# EasyEDA Pro project 完模主板.eprj

# Schematic Schematic1
Board Name: Board1; Create Date: 2025-03-10; Page Name: P1; Project Name: 完模1; Schematic Name: Schematic1; Update Date: 2025-05-26; Company: 嘉立创EDA; Page Size: A4; Version: V1.0
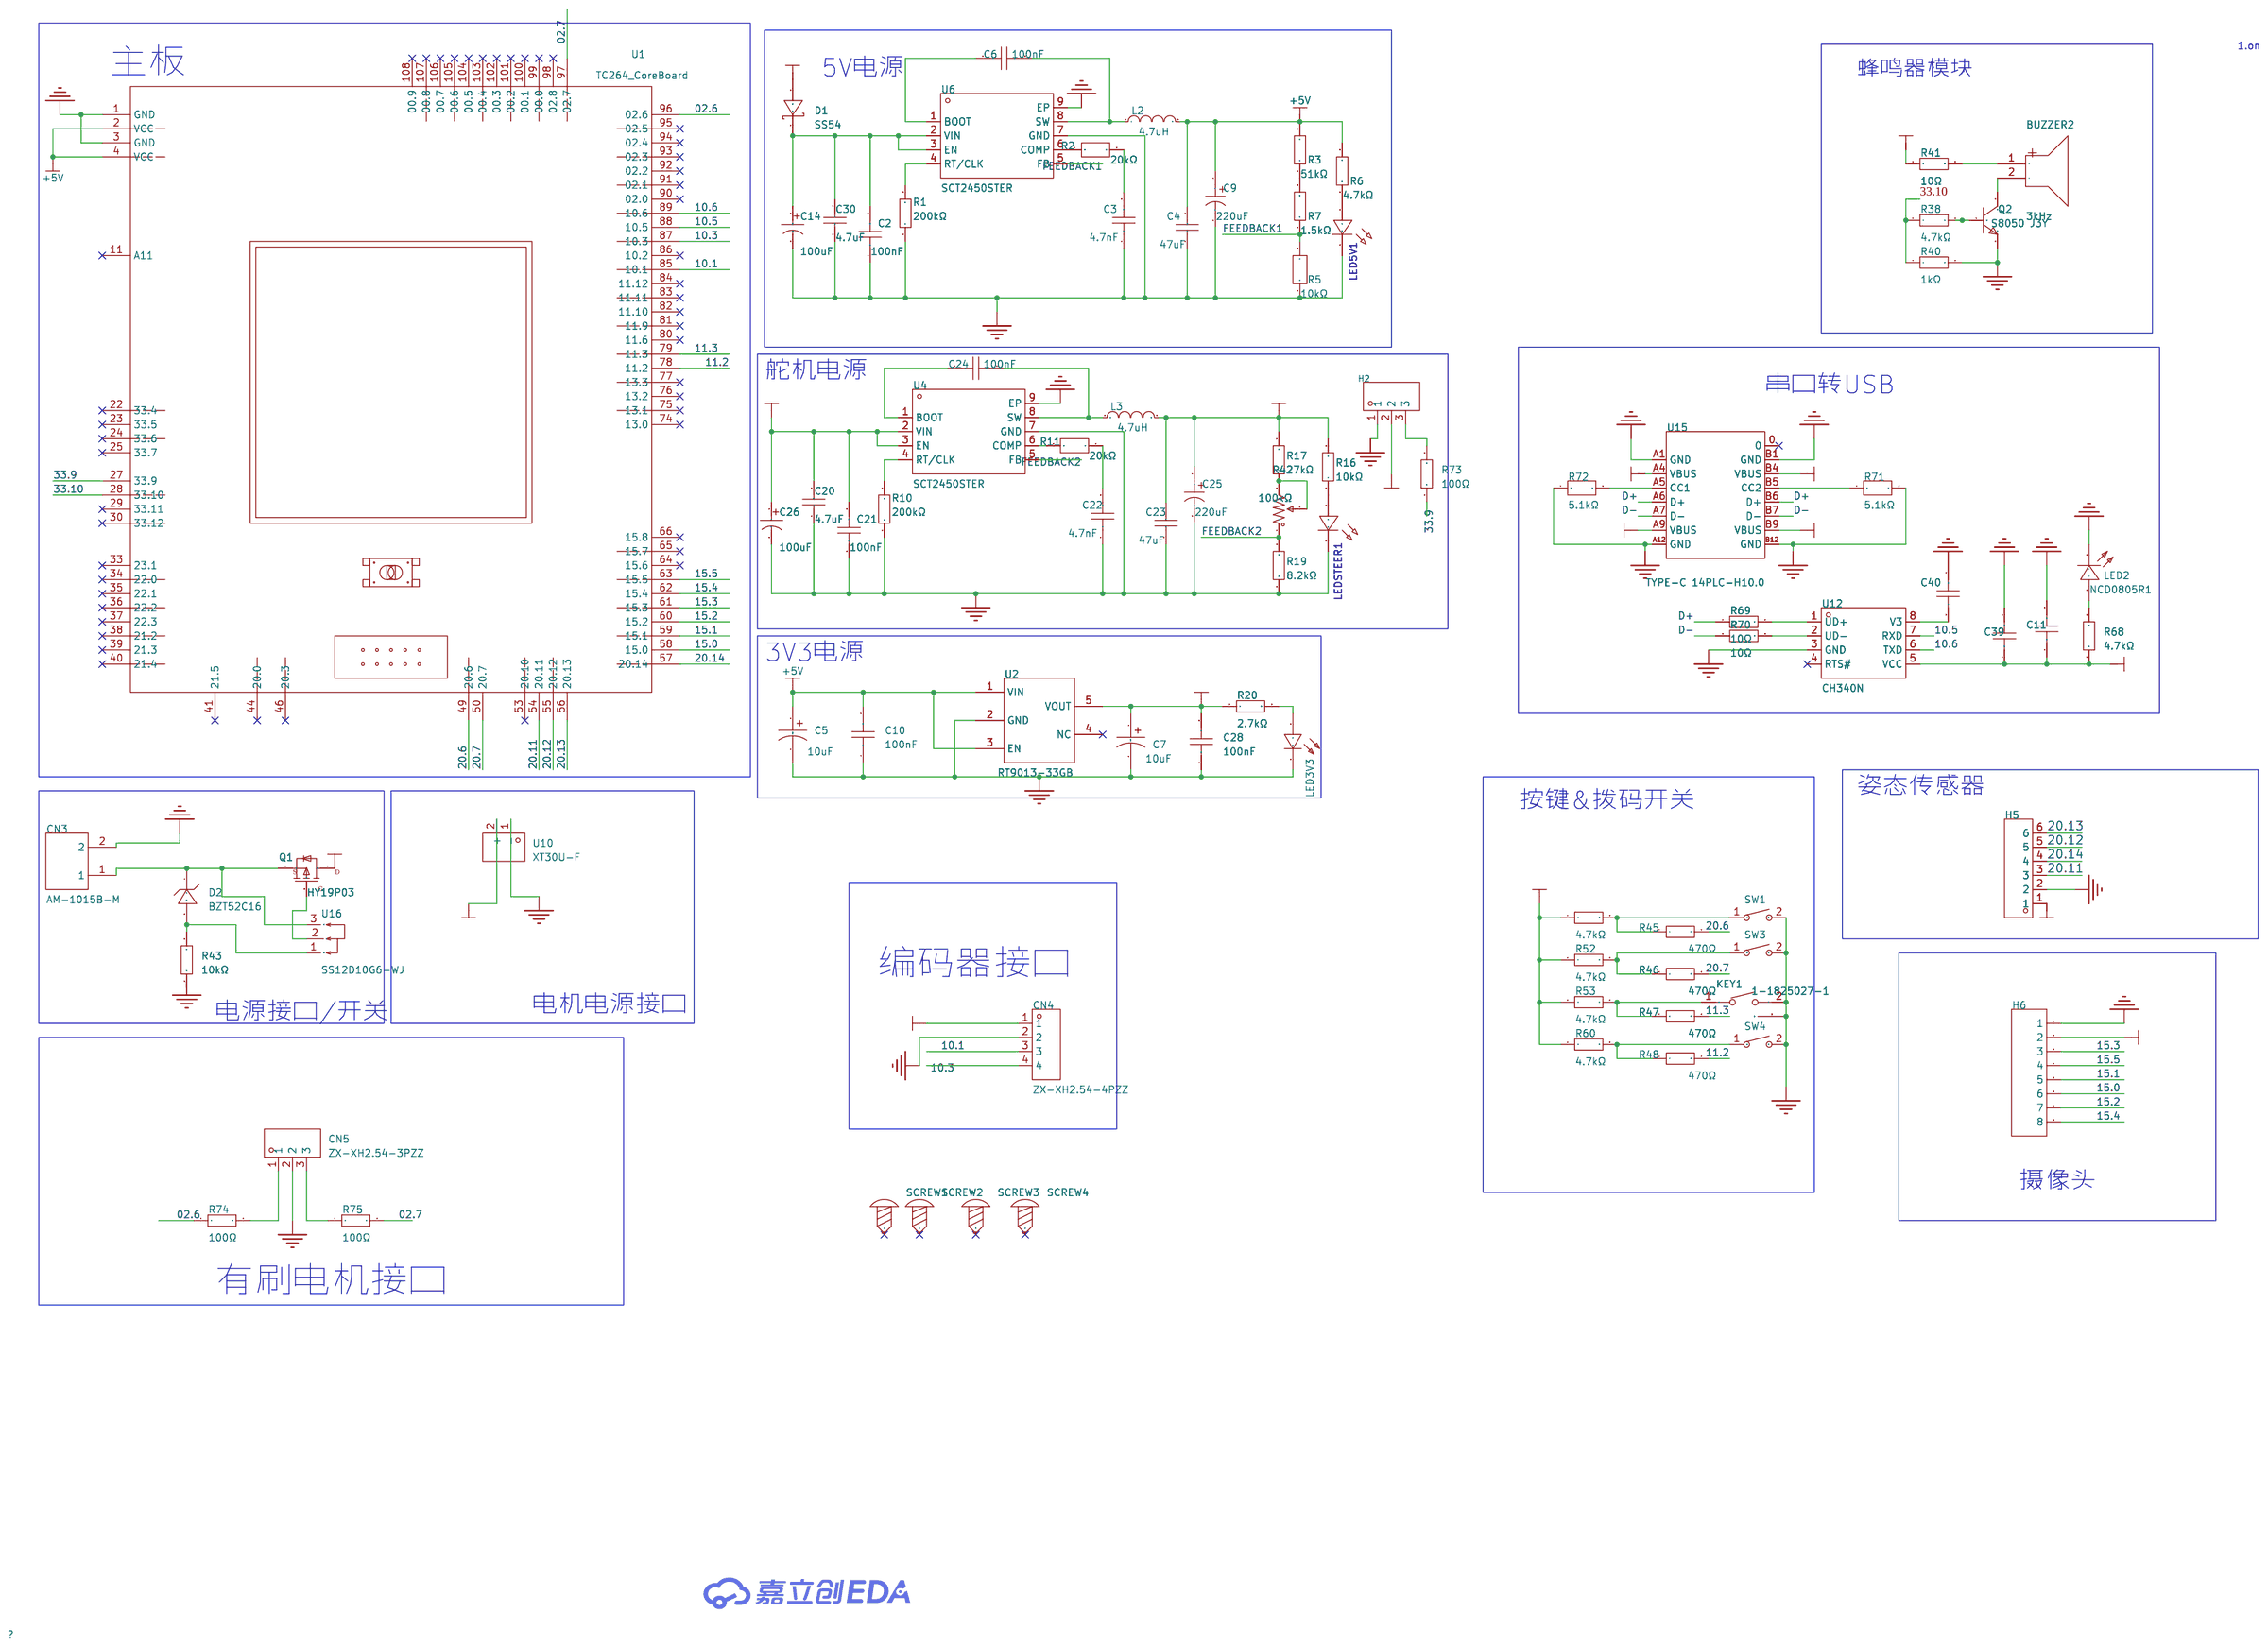
[diagram p0: schematic sheet]

## Parts
BUZZER2  3kHz  [BUZ-TH_BD9.0-P5.00-D0.6-FD]
C2  100nF  [C0603]
C3  4.7nF  [C0603]
C4  47uF  [C0603]
C5  10uF  [CAP-SMD_BD4.0-L4.3-W4.3-LS5.3-FD]
C6  100nF  [C0603]
C7  10uF  [CAP-SMD_BD4.0-L4.3-W4.3-LS5.3-FD]
C9  220uF  [CAP-TH_BD6.3-P2.50-D0.6-FD-1]
C10  100nF  [C0603]
C11  100nF  [C0603]
C14  100uF  [CAP-TH_BD6.3-P2.50-D1.0-FD]
C20  4.7uF  [C0603]
C21  100nF  [C0603]
C22  4.7nF  [C0603]
C23  47uF  [C0603]
C24  100nF  [C0603]
C25  220uF  [CAP-TH_BD6.3-P2.50-D0.6-FD-1]
C26  100uF  [CAP-TH_BD6.3-P2.50-D1.0-FD]
C28  100nF  [C0603]
C30  4.7uF  [C0603]
C39  100nF  [C0603]
C40  100nF  [C0603]
CN3  AM-1015B-M  [CONN-TH_AM-1015B-M]
CN4  ZX-XH2.54-4PZZ  [CONN-TH_4P-P2.50_4PIN]
CN5  ZX-XH2.54-3PZZ  [CONN-TH_3P-P2.54_2501S-3P]
D1  SS54  [SMA_L4.4-W2.8-LS5.4-R-RD]
D2  BZT52C16  [SOD-123_L2.7-W1.6-LS3.7-RD]
H2  PZ254V-11-03P  [HDR-TH_3P-P2.54-V-M]
H5  PZ254V-11-06P  [HDR-TH_6P-P2.54-V-M]
H6  -  [HDR-TH_8P-P2.54-V-M]
KEY1  1-1825027-1  [KEY-TH_1-1825027-1]
L2  4.7uH  [IND-SMD_L5.4-W5.2_FXL0530]
L3  4.7uH  [IND-SMD_L5.4-W5.2_FXL0530]
LED2  NCD0805R1  [LED0805-RD]
LED3V3  SML-H12P8TT86  [LED0805-R-RD_GREEN]
LED5V1  -  [LED_0805]
LEDSTEER1  -  [LED_0805]
Q1  HY19P03  [TO-252AA-TO-252AA_N]
Q2  S8050 J3Y  [SOT-23-3_L3.0-W1.7-P0.95-LS2.9-BR]
R1  200kΩ  [R0603]
R2  20kΩ  [R0603]
R3  51kΩ  [R0603]
R5  10kΩ  [R0603]
R6  4.7kΩ  [R0603]
R7  1.5kΩ  [R0603]
R10  200kΩ  [R0603]
R11  20kΩ  [R0603]
R16  10kΩ  [R0603]
R17  27kΩ  [R0603]
R19  8.2kΩ  [R0603]
R20  2.7kΩ  [R0603]
R38  4.7kΩ  [R0603]
R40  1kΩ  [R0603]
R41  10Ω  [R0603]
R42  100kΩ  [RES-ADJ-TH_3P-L9.7-W5.0-P2.54_T93YA203KT20]
R43  10kΩ  [R0805]
R45  470Ω  [R0603]
R46  470Ω  [R0603]
R47  470Ω  [R0603]
R48  470Ω  [R0603]
R51  4.7kΩ  [R0603]
R52  4.7kΩ  [R0603]
R53  4.7kΩ  [R0603]
R60  4.7kΩ  [R0603]
R68  4.7kΩ  [R0603]
R69  10Ω  [R0603]
R70  10Ω  [R0603]
R71  5.1kΩ  [R0603]
R72  5.1kΩ  [R0603]
R73  100Ω  [R0603]
R74  100Ω  [R0603]
R75  100Ω  [R0603]
SCREW1  -  [M3螺丝]
SCREW2  -  [M3螺丝]
SCREW3  -  [M3螺丝]
SCREW4  -  [M3螺丝]
SW1  TS665WS 200gf(016)  [SW-SMD_L6.0-W6.0-P6.00-LS6.6]
SW3  TS665WS 200gf(016)  [SW-SMD_L6.0-W6.0-P6.00-LS6.6]
SW4  TS665WS 200gf(016)  [SW-SMD_L6.0-W6.0-P6.00-LS6.6]
U1  TC264_CoreBoard  [TC264_main]
U2  RT9013-33GB  [SOT-23-5_L3.0-W1.7-P0.95-LS2.8-BL]
U4  SCT2450STER  [ESOP-8_L4.9-W3.9-P1.27-LS6.0-BL-EP]
U6  SCT2450STER  [ESOP-8_L4.9-W3.9-P1.27-LS6.0-BL-EP]
U10  XT30U-F  [CONN-TH_XT30U-F]
U12  CH340N  [SOP-8_L4.9-W3.9-P1.27-LS6.0-BL]
U15  TYPE-C 14PLC-H10.0  [USB-C-TH_SHOUHAN_TYPE-C-14PLC-H10.0]
U16  SS12D10G6-WJ  [SW-TH_3P-P4.80_HX-SS12D10G6-WJ]

## Library data of the parts
BUZZER2 = HNB09A03: 驱动方式:有源(内含驱动线路);构造类型:电磁式;频率:3kHz;声压(SPL):85dB;; LCSC Part Name: 电磁式有源一体蜂鸣器HNB09A03; Supplier Part: C96102; Manufacturer: 华能; Supplier Footprint: 插件,D=9mm; JLCPCB Part Class: 扩展库; Datasheet: https://atta.szlcsc.com/upload/public/pdf/source/20241128/61C4C8C3938BB25F7C38FBE94CCE8DCF.pdf; Supplier: LCSC; Driver Circuitry: 有源(内含驱动线路); Technology: 电磁式; Voltage - Supply: 1.5V~4.5V; Current Consumption: 30mA; Sound Pressure Level(SPL): 85dB; Diameter(φD): 9mm; Height: 5.5mm; Operating Temperature: -20℃~+70℃
C2 C6 C10 C21 C24 C28 = CGA0603X7R104K500JT: 容值:100nF;精度:±10%;额定电压:50V;材质(温度系数):X7R;; LCSC Part Name: 100nF ±10% 50V; Supplier Part: C6119867; Manufacturer: HRE(芯声); Supplier Footprint: 0603; JLCPCB Part Class: 扩展库; Supplier: LCSC; Tolerance: ±10%; Voltage Rated: 50V; Temperature Coefficient: X7R
C3 C22 = CGA0603X7R472K500JT: 容值:4.7nF;精度:±10%;额定电压:50V;材质(温度系数):X7R;; LCSC Part Name: 4.7nF ±10% 50V; Supplier Part: C7503499; Manufacturer: HRE(芯声); Supplier Footprint: 0603; JLCPCB Part Class: 扩展库; Supplier: LCSC; Tolerance: ±10%; Voltage Rated: 50V; Temperature Coefficient: X7R
C4 C23 = GRM188R60J476ME15D: 容值:47uF;精度:±20%;额定电压:6.3V;材质(温度系数):X5R;; LCSC Part Name: 47uF ±20% 6.3V; Supplier Part: C140782; Manufacturer: muRata(村田); Supplier Footprint: 0603; JLCPCB Part Class: 扩展库; Datasheet: https://atta.szlcsc.com/upload/public/pdf/source/20171113/C140782_15105612981581115778.pdf; Supplier: LCSC; Tolerance: ±20%; Voltage Rated: 6.3V; Temperature Coefficient: X5R
C5 C7 = UWX1C100MCL1GB: 容值:10uF;精度:±20%;额定电压:16V;纹波电流:23mA@120Hz;等效串联电阻:-;; LCSC Part Name: 10uF ±20% 16V; Supplier Part: C445047; Manufacturer: Nichicon(尼吉康); Supplier Footprint: SMD,D4xL5.4mm; JLCPCB Part Class: Extended Part; Datasheet: https://atta.szlcsc.com/upload/public/pdf/source/20191118/C445054_21BB3AEDE2A60A435477784FBA04E610.pdf; Supplier: LCSC; Tolerance: ±20%; Rated Voltage: 16V; Ripple Current: 23mA@120Hz; φD: 4mm; L: 5.4mm; Lifetime @ Temp: 2000hrs@85℃; Operating Temperature: -40℃~+85℃
C9 C25 = KNE2220UF25V149EC0030: 容值:220uF;精度:±20%;额定电压:25V;纹波电流:3.1A@100kHz;等效串联电阻:18mΩ@100kHz;; LCSC Part Name: 220uF ±20% 25V; Supplier Part: C2943986; Manufacturer: KNSCHA(科尼盛); Supplier Footprint: 插件,D6.3xL8mm; JLCPCB Part Class: 扩展库; Datasheet: https://atta.szlcsc.com/upload/public/pdf/source/20220426/6D36ABCEAFF08C1F9183CDC059524FCA.pdf; Supplier: LCSC; Tolerance: ±20%; Rated Voltage: 25V; Ripple Current: 3.1A@100kHz; Equivalent Series Resistance(ESR): 18mΩ@100kHz; Lead Spacing: 2.5mm; φD: 6.3mm; L: 8mm; Lifetime @ Temp: 2000hrs@105℃; Operating Temperature: -55℃~+105℃
C11 C39 C40 = CC0603KRX7R9BB104: 容值:100nF;精度:±10%;额定电压:50V;材质(温度系数):X7R;; LCSC Part Name: 100nF ±10% 50V; Supplier Part: C14663; Manufacturer: YAGEO(国巨); Supplier Footprint: 0603; JLCPCB Part Class: Basic Part; Datasheet: https://atta.szlcsc.com/upload/public/pdf/source/20180910/C282072_33301C7F631E79921B82A8DAC6BCC5B3.pdf; Supplier: LCSC; Tolerance: ±10%; Voltage Rated: 50V; Temperature Coefficient: X7R
C14 C26 = SPZ1VM101E08O00RAXXX: 容值:100uF;精度:±20%;额定电压:35V;纹波电流:2.35A@100kHz;等效串联电阻:50mΩ@100kHz;类型:-;; LCSC Part Name: 100uF ±20% 35V; Supplier Part: C122240; Manufacturer: AISHI(艾华集团); Supplier Footprint: 插件,D6.3xL8mm; JLCPCB Part Class: 扩展库; Datasheet: https://atta.szlcsc.com/upload/public/pdf/source/20170721/C122240_1500619276730834029.pdf; Supplier: LCSC; Tolerance: ±20%; Rated Voltage: 35V; Ripple Current: 2.35A@100kHz; Equivalent Series Resistance(ESR): 50mΩ@100kHz; Lead Spacing: 2.5mm; φD: 6.3mm; L: 8mm; Lifetime @ Temp: 2000hrs@105℃; Operating Temperature: -55℃~+105℃
C20 C30 = CL10A475KO8NNNC: 容值:4.7uF;精度:±10%;额定电压:16V;材质(温度系数):X5R;; LCSC Part Name: 4.7uF ±10% 16V; Supplier Part: C19666; Manufacturer: SAMSUNG(三星); Supplier Footprint: 0603; JLCPCB Part Class: 基础库; Datasheet: https://atta.szlcsc.com/upload/public/pdf/source/20160218/1457707763339.pdf; Supplier: LCSC; Tolerance: ±10%; Voltage Rated: 16V; Temperature Coefficient: X5R
CN3 = AM-1015B-M: LCSC Part Name: AMASS(艾迈斯)电源连接器公头AM-1015B-M; Supplier Part: C90631; Manufacturer: AMASS(艾迈斯); JLCPCB Part Class: 扩展库; Datasheet: https://atta.szlcsc.com/upload/public/pdf/source/20161217/1481939174683.pdf; Supplier: LCSC; Brand: 艾迈斯; Type: T行插头; RatedVoltage: DC 500V; InterfaceType: 双公头; MetalMaterial: 铜镀金; InsulationMaterial: PA; RatedCurrent: 25A; RecommendedWireGauge: 12AWG; FlameRetardantGrade: UL94 V0; contact resistance: 0.45mΩ
CN4 = ZX-XH2.54-4PZZ: LCSC Part Name: 1x4P 间距:2.5mm 直插 系列:XH; Supplier Part: C7429634; Manufacturer: Megastar(兆星); Supplier Footprint: 插件,P=2.5mm; JLCPCB Part Class: 扩展库; Datasheet: https://atta.szlcsc.com/upload/public/pdf/source/20230619/B529A2163E0159A644AB3383D208FB03.pdf; Supplier: LCSC; Pins Structure: 1x4P; Pitch: 2.5mm; Mounting Type: 直插; Reference Series: XH; Number of Pins: 4P; Number of Rows: 1; Number of PINs Per Row: 4; Rated Current: 3A; Contact Material: 黄铜; Contact Plating: 锡; Operating Temperature: -25℃~+85℃; Rated Voltage (Max): 250V; Plastic Material: PA66; Flame Retardant Rating: UL94V-0; Color: 白色; Z-Height of the Board: 7mm; X-Length of Bottom Edge on Board (Spacing Line): 12.5mm; Y-Width of Bottom Edge on Board: 5.9mm
CN5 = ZX-XH2.54-3PZZ: LCSC Part Name: 1x3P 间距:2.5mm 直插 系列:XH; Supplier Part: C7429633; Manufacturer: Megastar(兆星); Supplier Footprint: 插件,P=2.5mm; JLCPCB Part Class: 扩展库; Datasheet: https://atta.szlcsc.com/upload/public/pdf/source/20230619/AE17037A2CFDBE8D9CBA775D61AD0A84.pdf; Supplier: LCSC; Pins Structure: 1x3P; Pitch: 2.5mm; Mounting Type: 直插; Reference Series: XH; Number of Pins: 3P; Number of Rows: 1; Number of PINs Per Row: 3; Rated Current: 3A; Contact Material: 黄铜; Contact Plating: 锡; Operating Temperature: -25℃~+85℃; Rated Voltage (Max): 250V; Plastic Material: PA66; Flame Retardant Rating: UL94V-0; Color: 白色; Z-Height of the Board: 7mm; X-Length of Bottom Edge on Board (Spacing Line): 10mm; Y-Width of Bottom Edge on Board: 5.9mm
D1 = SS54_C22452: 直流反向耐压(Vr):40V;平均整流电流(Io):5A;正向压降(Vf):550mV@5A;; LCSC Part Name: 40V 5A 550mV@5A; Supplier Part: C22452; Manufacturer: MDD; Supplier Footprint: SMA(DO-214AC); JLCPCB Part Class: Basic Part; Datasheet: https://atta.szlcsc.com/upload/public/pdf/source/20230314/529CD85F9B31F69841D3A079BC07E377.pdf; Supplier: LCSC; Reverse Voltage (Vr): 40V; Average Rectified Current (Io): 5A; Forward Voltage (Vf@If): 550mV@5A
D2 = BZT52C16_C266570: 二极管配置:独立式;稳压值(标称值):16V;稳压值(范围):15.3V~17.1V;功率:500mW;精度:-;; Supplier Part: C266570; Manufacturer: BORN(伯恩半导体); Supplier Footprint: SOD-123; JLCPCB Part Class: Extended Part; Datasheet: https://atta.szlcsc.com/upload/public/pdf/source/20180820/C271262_D2D0F24DD5A81EAE2A6B8B493A94E64A.pdf; Supplier: LCSC; Diode Configuration: 独立式; Zener Voltage (Nom): 16V; Reverse Leakage Current (Ir): 100nA@11.2V; Zener Voltage (Range): 15.3V~17.1V; Power Dissipation: 500mW; Zener Impedance (Zzt): 40Ω
H2 = PZ254V-11-03P: 插针结构:1x3P;间距:2.54mm;行距:-;圆针/方针:方针;安装类型:直插;排数:单排;总PIN位数:3P;额定电流:3A;额定电压:250V;配合针长度:6mm;塑高:2.5mm;端接针长度:3mm;工作温度范围:-40℃~+105℃;颜色:黑色;; LCSC Part Name: 间距:2.54mm 1x3P 直插 方针; Supplier Part: C2937625; Manufacturer: XFCN(兴飞); Supplier Footprint: 插件,P=2.54mm; JLCPCB Part Class: Extended Part; Datasheet: https://atta.szlcsc.com/upload/public/pdf/source/20200309/C492402_8335C3D49C4E4C618838D59BB1D024C1.pdf; Supplier: LCSC; Pin Structure: 1x3P; Pitch: 2.54mm; Circluar Pins/Square Pins: 方针; Mounting Type: 直插; Number of Rows: 单排; Number of Pins: 3P; Current Rating (Max): 3A; Voltage Rating (Max): 250V; Length of Mating Pin: 6mm; Insulation Height: 2.5mm; Length of End Connection Pin: 3mm; Operating Temperature Range: -40℃~+105℃; Color: 黑色
H5 = PZ254V-11-06P: 插针结构:1x6P;间距:2.54mm;行距:-;圆针/方针:方针;安装类型:直插;排数:单排;总PIN位数:6P;额定电流:-;额定电压:-;配合针长度:6mm;塑高:2.5mm;端接针长度:3mm;触头材质:黄铜;触头镀层:-;工作温度范围:-40℃~+105℃;颜色:黑色;; LCSC Part Name: 间距:2.54mm 1x6P 直插 方针; Supplier Part: C492405; Manufacturer: XFCN(兴飞); Supplier Footprint: 插件,P=2.54mm; JLCPCB Part Class: 扩展库; Datasheet: https://atta.szlcsc.com/upload/public/pdf/source/20200309/C492405_597F1930F5B55CC3C7FD95458F1C3977.pdf; Supplier: LCSC; Pin Structure: 1x6P; Pitch: 2.54mm; Circluar Pins/Square Pins: 方针; Mounting Type: 直插; Number of Rows: 单排; Number of Pins: 6P; Length of Mating Pin: 6mm; Insulation Height: 2.5mm; Length of End Connection Pin: 3mm; Contact Material: 黄铜; Operating Temperature Range: -40℃~+105℃; Color: 黑色
H6 = HDR-M_2.54_1x8P: Supplier Part: C124381; Supplier Footprint: 插件
KEY1 = 1-1825027-1: 电路结构:单刀单掷;按钮形状:圆形按钮;作用力:160gf;安装方式:卧插;开关高度:5.74mm;触点电流:50mA;额定电压(DC):24V;带灯:-;机械寿命:-;; Supplier Part: C266183; Manufacturer: TE Connectivity(泰科电子); Supplier Footprint: 插件; JLCPCB Part Class: 扩展库; Datasheet: https://atta.szlcsc.com/upload/public/pdf/source/20181008/C266196_6FA61FEFE8BA11E812126A7DC7B2D0B1.pdf; Supplier: LCSC; Circuit: 单刀单掷; Actuator Style: 圆形按钮; Operating Force: 160gf; Mounting Style: 卧插; Switch Height: 5.74mm; Contact Current: 50mA; Voltage Rating (DC): 24V; Pin Style: PC引脚; Operating Temperature: -20℃~+105℃
L2 L3 = FXL0530-4R7-M: 电感值:4.7uH;精度:±20%;额定电流:4.5A;饱和电流(Isat):5A;类型:一体成型电感;; LCSC Part Name: 4.7uH ±20% 5A; Supplier Part: C177246; Manufacturer: cjiang(长江微电); Supplier Footprint: SMD,5.2x5.4mm; JLCPCB Part Class: 扩展库; Datasheet: https://atta.szlcsc.com/upload/public/pdf/source/20240426/3189EA8206330E2108542F9E34E540E7.pdf; Supplier: LCSC; Tolerance: ±20%; Rated Current: 4.5A; Saturation Current (Isat): 5A; DC Resistance (DCR): 60mΩ; Type: 一体成型电感
LED2 = NCD0805R1: 发光颜色:红灯;; LCSC Part Name: 红灯; Supplier Part: C84256; Manufacturer: 国星光电; Supplier Footprint: 0805; JLCPCB Part Class: Basic Part; Datasheet: https://atta.szlcsc.com/upload/public/pdf/source/20200820/C84256_F0A75A43B3EAD75808600A0514C76B99.pdf; Supplier: LCSC; Emitted Color: 红灯
LED3V3 = SML-H12P8TT86: 发光颜色:普绿/黄绿;二极管配置:-;透镜颜色:-;主波长:560nm;峰值波长:-;色温:-;测试电流:20mA;功率:54mW;发光角度:-;安装方式:-;工作温度:-40℃~+85℃;; LCSC Part Name: 普绿/黄绿 560nm; Supplier Part: C510035; Manufacturer: ROHM(罗姆); Supplier Footprint: 0805; JLCPCB Part Class: Extended Part; Datasheet: https://atta.szlcsc.com/upload/public/pdf/source/20210730/C2857858_08A8915CF3BFC41C1E16B5C223922007.pdf; Supplier: LCSC; Emitted Color: 普绿/黄绿; Dominant Wavelength: 560nm; Forward Current: 20mA; Power Dissipation: 54mW; Operating Temperature: -40℃~+85℃
LED5V1 LEDSTEER1 = LED_0805-G: Supplier Footprint: 0805
Q1 = HY19P03
Q2 = S8050 J3Y_C2146: 晶体管类型:NPN;集电极电流(Ic):500mA;集射极击穿电压(Vceo):25V;功率(Pd):300mW;集电极-发射极饱和电压(VCE(sat)@Ic,Ib):600mV@500mA,50mA;直流电流增益(hFE@Ic,Vce):200@50mA,1V;特征频率(fT):150MHz;工作温度:+150℃@(Tj);; LCSC Part Name: NPN Vceo=25V 300mW Icbo=100nA (200-350); Supplier Part: C2146; Manufacturer: CJ（江苏长电/长晶）; Supplier Footprint: SOT-23(SOT-23-3); JLCPCB Part Class: Basic Part; Datasheet: https://atta.szlcsc.com/upload/public/pdf/source/20140809/1457707209234.pdf; Supplier: LCSC; Transistor Type: NPN; Collector Current (Ic): 500mA; Collector-Emitter Breakdown Voltage (Vceo): 25V; Power Dissipation (Pd): 300mW; Collector-Emitter Saturation Voltage (VCE(sat)@Ic,Ib): 600mV@500mA,50mA; DC Current Gain (hFE@Ic,Vce): 200@50mA,1V; Transition Frequency (fT): 150MHz; Operating Temperature: +150℃@(Tj)
R1 R10 = 0603WAF2003T5E: 电阻类型:厚膜电阻;阻值:200kΩ;精度:±1%;功率:100mW;最大工作电压:75V;温度系数:±100ppm/℃;; LCSC Part Name: 200kΩ ±1% 100mW 厚膜电阻; Supplier Part: C25811; Manufacturer: UNI-ROYAL(厚声); Supplier Footprint: 0603; JLCPCB Part Class: 基础库; Datasheet: https://atta.szlcsc.com/upload/public/pdf/source/20200306/C422600_1E6D84923E4A46A82E41ADD87F860B5C.pdf; Supplier: LCSC; Type: 厚膜电阻; Tolerance: ±1%; Power(Watts): 100mW; Overload Voltage (Max): 75V; Temperature Coefficient: ±100ppm/℃; Operating Temperature Range: -55℃~+155℃
R2 R11 = RT0603BRD0720KL: 电阻类型:薄膜电阻;阻值:20kΩ;精度:±0.1%;功率:100mW;最大工作电压:75V;温度系数:±25ppm/℃;; LCSC Part Name: 薄膜电阻 20kΩ ±0.1% 100mW; Supplier Part: C723637; Manufacturer: YAGEO(国巨); Supplier Footprint: 0603; JLCPCB Part Class: 扩展库; Datasheet: https://atta.szlcsc.com/upload/public/pdf/source/20200814/C723637_57E5E8B3C02F5D5BA42E401EB3E82C8B.pdf; Supplier: LCSC; Type: 薄膜电阻; Tolerance: ±0.1%; Power(Watts): 100mW; Overload Voltage (Max): 75V; Temperature Coefficient: ±25ppm/℃; Operating Temperature Range: -55℃~+155℃
R3 = 0603WAF5102T5E: 电阻类型:厚膜电阻;阻值:51kΩ;精度:±1%;功率:100mW;最大工作电压:75V;温度系数:±100ppm/℃;; LCSC Part Name: 51kΩ ±1% 100mW 厚膜电阻; Supplier Part: C23196; Manufacturer: UNI-ROYAL(厚声); Supplier Footprint: 0603; JLCPCB Part Class: 基础库; Datasheet: https://atta.szlcsc.com/upload/public/pdf/source/20200306/C422600_1E6D84923E4A46A82E41ADD87F860B5C.pdf; Supplier: LCSC; Type: 厚膜电阻; Tolerance: ±1%; Power(Watts): 100mW; Overload Voltage (Max): 75V; Temperature Coefficient: ±100ppm/℃; Operating Temperature Range: -55℃~+155℃
R5 = FRC0603J103TS: 电阻类型:厚膜电阻;阻值:10kΩ;精度:±5%;功率:100mW;最大工作电压:75V;温度系数:±100ppm/℃;; LCSC Part Name: 10kΩ ±5% 100mW 厚膜电阻; Supplier Part: C2930027; Manufacturer: FOJAN(富捷); Supplier Footprint: 0603; JLCPCB Part Class: 扩展库; Datasheet: https://atta.szlcsc.com/upload/public/pdf/source/20211221/925EC7D7225764EE0046F22065062C87.pdf; Supplier: LCSC; Type: 厚膜电阻; Tolerance: ±5%; Power(Watts): 100mW; Overload Voltage (Max): 75V; Temperature Coefficient: ±100ppm/℃; Operating Temperature Range: -55℃~+155℃
R6 = RC0603FR-074K7L: 电阻类型:厚膜电阻;阻值:4.7kΩ;精度:±1%;功率:100mW;最大工作电压:75V;温度系数:±100ppm/℃;; LCSC Part Name: 厚膜电阻 4.7kΩ ±1% 100mW; Supplier Part: C99782; Manufacturer: YAGEO(国巨); Supplier Footprint: 0603; JLCPCB Part Class: 扩展库; Datasheet: https://atta.szlcsc.com/upload/public/pdf/source/20180224/C181757_15194369480721363983.pdf; Supplier: LCSC; Type: 厚膜电阻; Tolerance: ±1%; Power(Watts): 100mW; Overload Voltage (Max): 75V; Temperature Coefficient: ±100ppm/℃; Operating Temperature Range: -55℃~+155℃
R7 = 0603WAF1501T5E: 电阻类型:厚膜电阻;阻值:1.5kΩ;精度:±1%;功率:100mW;最大工作电压:75V;温度系数:±100ppm/℃;; LCSC Part Name: 1.5kΩ ±1% 100mW 厚膜电阻; Supplier Part: C22843; Manufacturer: UNI-ROYAL(厚声); Supplier Footprint: 0603; JLCPCB Part Class: 基础库; Datasheet: https://atta.szlcsc.com/upload/public/pdf/source/20200306/C422600_1E6D84923E4A46A82E41ADD87F860B5C.pdf; Supplier: LCSC; Type: 厚膜电阻; Tolerance: ±1%; Power(Watts): 100mW; Overload Voltage (Max): 75V; Temperature Coefficient: ±100ppm/℃; Operating Temperature Range: -55℃~+155℃
R16 = 0603WAF1002T5E: 电阻类型:厚膜电阻;阻值:10kΩ;精度:±1%;功率:100mW;最大工作电压:75V;温度系数:±100ppm/℃;; LCSC Part Name: 厚膜电阻 10kΩ ±1% 100mW; Supplier Part: C25804; Manufacturer: UNI-ROYAL(厚声); Supplier Footprint: 0603; JLCPCB Part Class: 基础库; Datasheet: https://atta.szlcsc.com/upload/public/pdf/source/20200306/C422600_1E6D84923E4A46A82E41ADD87F860B5C.pdf; Supplier: LCSC; Type: 厚膜电阻; Tolerance: ±1%; Power(Watts): 100mW; Overload Voltage (Max): 75V; Temperature Coefficient: ±100ppm/℃; Operating Temperature Range: -55℃~+155℃
R17 = 0603WAF2702T5E: 电阻类型:厚膜电阻;阻值:27kΩ;精度:±1%;功率:100mW;最大工作电压:75V;温度系数:±100ppm/℃;; LCSC Part Name: 27kΩ ±1% 100mW 厚膜电阻; Supplier Part: C22967; Manufacturer: UNI-ROYAL(厚声); Supplier Footprint: 0603; JLCPCB Part Class: 基础库; Datasheet: https://atta.szlcsc.com/upload/public/pdf/source/20200306/C422600_1E6D84923E4A46A82E41ADD87F860B5C.pdf; Supplier: LCSC; Type: 厚膜电阻; Tolerance: ±1%; Power(Watts): 100mW; Overload Voltage (Max): 75V; Temperature Coefficient: ±100ppm/℃; Operating Temperature Range: -55℃~+155℃
R19 = 0603WAF8201T5E: 电阻类型:厚膜电阻;阻值:8.2kΩ;精度:±1%;功率:100mW;最大工作电压:75V;温度系数:±100ppm/℃;; LCSC Part Name: 8.2kΩ ±1% 100mW 厚膜电阻; Supplier Part: C25981; Manufacturer: UNI-ROYAL(厚声); Supplier Footprint: 0603; JLCPCB Part Class: 基础库; Datasheet: https://atta.szlcsc.com/upload/public/pdf/source/20200306/C422600_1E6D84923E4A46A82E41ADD87F860B5C.pdf; Supplier: LCSC; Type: 厚膜电阻; Tolerance: ±1%; Power(Watts): 100mW; Overload Voltage (Max): 75V; Temperature Coefficient: ±100ppm/℃; Operating Temperature Range: -55℃~+155℃
R20 = 0603WAF2701T5E: 电阻类型:厚膜电阻;阻值:2.7kΩ;精度:±1%;功率:100mW;最大工作电压:75V;温度系数:±100ppm/℃;; LCSC Part Name: 2.7kΩ ±1% 100mW 厚膜电阻; Supplier Part: C13167; Manufacturer: UNI-ROYAL(厚声); Supplier Footprint: 0603; JLCPCB Part Class: 基础库; Datasheet: https://atta.szlcsc.com/upload/public/pdf/source/20200306/C422600_1E6D84923E4A46A82E41ADD87F860B5C.pdf; Supplier: LCSC; Type: 厚膜电阻; Tolerance: ±1%; Power(Watts): 100mW; Overload Voltage (Max): 75V; Temperature Coefficient: ±100ppm/℃; Operating Temperature Range: -55℃~+155℃
R38 R51-R53 R60 R68 = 0603WAF4701T5E: 电阻类型:厚膜电阻;阻值:4.7kΩ;精度:±1%;功率:100mW;最大工作电压:75V;温度系数:±100ppm/℃;; LCSC Part Name: 4.7kΩ ±1% 100mW 厚膜电阻; Supplier Part: C23162; Manufacturer: UNI-ROYAL(厚声); Supplier Footprint: 0603; JLCPCB Part Class: 基础库; Datasheet: https://atta.szlcsc.com/upload/public/pdf/source/20200306/C422600_1E6D84923E4A46A82E41ADD87F860B5C.pdf; Supplier: LCSC; Type: 厚膜电阻; Tolerance: ±1%; Power(Watts): 100mW; Overload Voltage (Max): 75V; Temperature Coefficient: ±100ppm/℃; Operating Temperature Range: -55℃~+155℃
R40 = 0603WAF1001T5E: 电阻类型:厚膜电阻;阻值:1kΩ;精度:±1%;功率:100mW;最大工作电压:75V;温度系数:±100ppm/℃;; LCSC Part Name: 1kΩ ±1% 100mW 厚膜电阻; Supplier Part: C21190; Manufacturer: UNI-ROYAL(厚声); Supplier Footprint: 0603; JLCPCB Part Class: 基础库; Datasheet: https://atta.szlcsc.com/upload/public/pdf/source/20200306/C422600_1E6D84923E4A46A82E41ADD87F860B5C.pdf; Supplier: LCSC; Type: 厚膜电阻; Tolerance: ±1%; Power(Watts): 100mW; Overload Voltage (Max): 75V; Temperature Coefficient: ±100ppm/℃; Operating Temperature Range: -55℃~+155℃
R41 R69 R70 = 0603WAF100JT5E: 电阻类型:厚膜电阻;阻值:10Ω;精度:±1%;功率:100mW;最大工作电压:75V;温度系数:±400ppm/℃;; LCSC Part Name: 10Ω ±1% 100mW 厚膜电阻; Supplier Part: C22859; Manufacturer: UNI-ROYAL(厚声); Supplier Footprint: 0603; JLCPCB Part Class: 基础库; Datasheet: https://atta.szlcsc.com/upload/public/pdf/source/20200306/C422600_1E6D84923E4A46A82E41ADD87F860B5C.pdf; Supplier: LCSC; Type: 厚膜电阻; Tolerance: ±1%; Power(Watts): 100mW; Overload Voltage (Max): 75V; Temperature Coefficient: ±400ppm/℃; Operating Temperature Range: -55℃~+155℃
R42 = T93YA104KT20: 阻值:100kΩ;精度:±10%;功率:500mW;温度系数:±100ppm/℃;; LCSC Part Name: 100kΩ ±10%; Supplier Part: C7061693; Manufacturer: VISHAY(威世); Supplier Footprint: SIP-3P,9.7x5mm; JLCPCB Part Class: 扩展库; Datasheet: https://atta.szlcsc.com/upload/public/pdf/source/20231218/7FD25C1CD39F3BC58AF7C524E54DAB62.pdf; Supplier: LCSC; Tolerance: ±10%; Power(Watts): 500mW; Temperature Coefficient: ±100ppm/℃; Turns: 21
R43 = 0805W8F1002T5E_C17414: 电阻类型:厚膜电阻;阻值:10kΩ;精度:±1%;功率:125mW;最大工作电压:150V;温度系数:±100ppm/℃;; LCSC Part Name: 10kΩ ±1% 125mW 厚膜电阻; Supplier Part: C17414; Manufacturer: UNI-ROYAL(厚声); Manufacturer Part: 0805W8F1002T5E; Supplier Footprint: 0805; JLCPCB Part Class: Basic Part; Datasheet: https://atta.szlcsc.com/upload/public/pdf/source/20200306/C422600_1E6D84923E4A46A82E41ADD87F860B5C.pdf; Supplier: LCSC; Type: 厚膜电阻; Tolerance: ±1%; Power(Watts): 125mW; Overload Voltage (Max): 150V; Temperature Coefficient: ±100ppm/℃; Operating Temperature Range: -55℃~+155℃
R45-R48 = 0603WAF4700T5E: 电阻类型:厚膜电阻;阻值:470Ω;精度:±1%;功率:100mW;最大工作电压:75V;温度系数:±100ppm/℃;; LCSC Part Name: 470Ω ±1% 100mW 厚膜电阻; Supplier Part: C23179; Manufacturer: UNI-ROYAL(厚声); Supplier Footprint: 0603; JLCPCB Part Class: 基础库; Datasheet: https://atta.szlcsc.com/upload/public/pdf/source/20200306/C422600_1E6D84923E4A46A82E41ADD87F860B5C.pdf; Supplier: LCSC; Type: 厚膜电阻; Tolerance: ±1%; Power(Watts): 100mW; Overload Voltage (Max): 75V; Temperature Coefficient: ±100ppm/℃; Operating Temperature Range: -55℃~+155℃
R71 R72 = FRC0603F5101TS: LCSC Part Name: 5.1kΩ ±1% 100mW 厚膜电阻; Supplier Part: C2907044; Manufacturer: FOJAN(富捷); Supplier Footprint: 0603; JLCPCB Part Class: 扩展库; Datasheet: https://atta.szlcsc.com/upload/public/pdf/source/20211221/925EC7D7225764EE0046F22065062C87.pdf; Supplier: LCSC; Type: 厚膜电阻; Tolerance: ±1%; Power(Watts): 100mW; Overload Voltage (Max): 75V; Temperature Coefficient: ±100ppm/℃; Operating Temperature Range: -55℃~+155℃
R73-R75 = 0603WAF1000T5E: 阻值:100Ω;精度:±1%;功率:100mW;温度系数:±200ppm/℃;电阻类型:厚膜电阻;; LCSC Part Name: 100Ω ±1% 100mW 厚膜电阻; Supplier Part: C22775; Manufacturer: UNI-ROYAL(厚声); Supplier Footprint: 0603; JLCPCB Part Class: Basic Part; Datasheet: https://atta.szlcsc.com/upload/public/pdf/source/20200306/C422600_1E6D84923E4A46A82E41ADD87F860B5C.pdf; Supplier: LCSC; Tolerance: ±1%; Power(Watts): 100mW; Overload Voltage (Max): 75V; Temperature Coefficient: ±200ppm/℃; Type: 厚膜电阻; Operating Temperature Range: -55℃~+155℃
SCREW1-SCREW4 = M3螺丝: Supplier Footprint: 插件
SW1 SW3 SW4 = TS665WS 200gf(016): 电路结构:单刀单掷;按钮形状:圆形按钮;作用力:2N;安装方式:立贴;开关长度:6mm;开关宽度:6mm;开关高度:5mm;带支架:不带;触点电流:50mA;额定电压(DC):12V;绝缘电阻:100MΩ;机械寿命:10万次;; LCSC Part Name: 6*6*5mm 立贴 轻触开关; Supplier Part: C2858277; Manufacturer: SHOU HAN(首韩); Supplier Footprint: SMD,6x6mm; JLCPCB Part Class: 扩展库; Datasheet: https://atta.szlcsc.com/upload/public/pdf/source/20240530/3BE9AD9361103ADE60EF38158F9D4976.pdf; Supplier: LCSC; Circuit: 单刀单掷; Actuator Style: 圆形按钮; Operating Force: 2N; Mounting Style: 立贴; Switch Length: 6mm; Switch Width: 6mm; Switch Height: 5mm; Strike Gundam: 不带; Contact Current: 50mA; Voltage Rating (DC): 12V; Insulation Resistance: 100MΩ; Actuator/Cap Color: 黑色; Pin Style: J型引脚; Mechanical Life: 10万次; Operating Temperature: -20℃~+80℃
U1 = TC264: NO_CONNECT: yes
U2 = RT9013-33GB: 输出类型:固定;最大输入电压:5.5V;输出电压:3.3V;最大输出电流:500mA;电源纹波抑制比(PSRR):50dB@(10kHz);输出极性:正极;; LCSC Part Name: 输入5.5V 输出3.3V 500mA; Supplier Part: C47773; Manufacturer: RICHTEK(立锜); Supplier Footprint: SOT-23-5; JLCPCB Part Class: 扩展库; Datasheet: https://atta.szlcsc.com/upload/public/pdf/source/20150504/1457707282459.pdf; Supplier: LCSC; Output Type: 固定; Maximum Input Voltage: 5.5V; Output Voltage: 3.3V; MAX Output Current: 500mA; Power Supply Rejection Ratio (PSRR): 50dB@(10kHz); Dropout Voltage: 400mV@(500mA); standby current: 50uA; Operating Temperature: -40℃~+85℃; Output Polarity: 正极; Number of Outputs: 1
U4 U6 = SCT2450STER: LCSC Part Name: 电源IC; Supplier Part: PP; Manufacturer: SCT(芯洲科技); Supplier Footprint: ESOP-8; JLCPCB Part Class: 扩展库; Datasheet: https://atta.szlcsc.com/upload/public/pdf/source/20200407/C509400_EDF779A672A59398CFBA9E95FA584FEC.pdf; Supplier: LCSC
U10 = XT30U-F: 类别:-;类型1:-;; LCSC Part Name: AMASS(艾迈斯)轻量版锂电池插头母头 XT30U-F; Supplier Part: C99102; Manufacturer: AMASS(艾迈斯); JLCPCB Part Class: Extended Part; Datasheet: https://atta.szlcsc.com/upload/public/pdf/source/20190916/C428721_B0ECB8C5937139CEFE8736D2D3175B0E.pdf; Supplier: LCSC; Brand: 艾迈斯; Type: 插头; Colour: 黄色; InterfaceType: 母头
U12 = CH340N: LCSC Part Name: USB转串口芯片 CH340; Supplier Part: C2977777; Manufacturer: WCH(南京沁恒); Supplier Footprint: SOP-8; JLCPCB Part Class: 扩展库; Datasheet: https://atta.szlcsc.com/upload/public/pdf/source/20230530/6E401E9554E9F5311886CC8B3F89B62E.pdf; Supplier: LCSC
U15 = TYPE-C 14PLC-H10.0: 连接器类型:Type-C;标准:USB 3.1;公母:母;安装方式:直插;触点数量:14P;端口数量:1;额定电流 - 电源:5A;触头材质:-;触头镀层:-;工作温度范围:-40℃~+85℃;; LCSC Part Name: Type-C 母 直插; Supplier Part: C3151746; Manufacturer: SHOU HAN(首韩); Supplier Footprint: 插件; JLCPCB Part Class: 扩展库; Datasheet: https://atta.szlcsc.com/upload/public/pdf/source/20220627/CFB3153B5198106DD3F3B6B367CF40F3.pdf; Supplier: LCSC; Connector Type: Type-C; Standard: USB 3.1; Gender: 母; Mounting Style: 直插; Number of Contacts: 14P; Number of Ports: 1; Current Rating - Power (Max): 5A; Operating Temperature Range: -40℃~+85℃; Rated Voltage (Max): 20V; Connect-Disconnect Life: 1万次; Core Colour: 黑色
U16 = SS12D10G6-WJ: LCSC Part Name: 两档卧式插件 3脚拨动开关弯插 柄长6.0mm; Supplier Part: C7431059; Manufacturer: SHOU HAN(首韩); Supplier Footprint: 插件; JLCPCB Part Class: 扩展库; Datasheet: https://atta.szlcsc.com/upload/public/pdf/source/20240716/65906E925F6A30FB5BD71C0F2E575DBB.pdf; Supplier: LCSC; Circuit: 单刀双掷; Actuator Style: 矩形柱状; Termination Style: PC引脚; Length: 12.7mm; Width: 6.7mm; Switch Height: 12.4mm; Mounting Type: 弯插; Actuator Color: 黑色; Current Rating: 2A; Voltage Rating: 125V; Life: 3千次; Operating Temperature: -25℃~+70℃

## Nets
12V: C20.2 C21.2 C26.1 D1.1(A) Q1.1(D) U4.2(VIN) U4.3(EN) U10.2(+)
+5V: C4.2 C5.1 C9.1 C10.2 L2.2 R3.2 R6.2 U1.2(VCC) U1.4(VCC) U2.1(VIN) U2.3(EN)
GND: C2.1 C3.1 C4.1 C5.2 C7.2 C9.2 C10.1 C11.2 C14.2 C20.1 C21.1 C22.1 C23.1 C25.2 C26.2 C28.1 C30.1 C39.2 C40.1 CN3.2 CN4.2 CN5.2 H2.1 H5.2 H6.1 KEY1.0 KEY1.2 LED2.1(-) LED3V3.2(C) LED5V1.1(C) LEDSTEER1.1(C) Q2.2(E) R1.1 R5.1 R10.1 R19.1 R40.2 R43.1 R71.2 R72.1 SW1.2 SW3.2 SW4.2 U1.1(GND) U1.3(GND) U2.2(GND) U4.7(GND) U4.9(EP) U6.7(GND) U6.9(EP) U10.1(-) U12.3(GND) U15.A1(GND) U15.A12(GND) U15.B1(GND) U15.B12(GND)
VBUS: C11.1 C39.1 R68.1 U12.5(VCC) U15.A4(VBUS) U15.A9(VBUS) U15.B4(VBUS) U15.B9(VBUS)
VCC3V3: C7.1 C28.2 CN4.1 H5.1 H6.2 R20.1 R41.1 R51.1 R52.1 R53.1 R60.1 U2.5(VOUT)
VCCSTEER: C23.2 C25.1 H2.2 L3.2 R16.2 R17.2
02.6: R74.1 U1.96(02.6)
02.7: R75.2 U1.97(02.7)
10.1: CN4.3 U1.85(10.1)
10.3: CN4.4 U1.87(10.3)
10.5: U1.88(10.5) U12.7(RXD)
10.6: U1.89(10.6) U12.6(TXD)
11.2: R48.2 U1.78(11.2)
11.3: R47.2 U1.79(11.3)
15.0: H6.6 U1.58(15.0)
15.1: H6.5 U1.59(15.1)
15.2: H6.7 U1.60(15.2)
15.3: H6.3 U1.61(15.3)
15.4: H6.8 U1.62(15.4)
15.5: H6.4 U1.63(15.5)
20.6: R45.2 U1.49(20.6)
20.7: R46.2 U1.50(20.7)
20.11: H5.3 U1.54(20.11)
20.12: H5.5 U1.55(20.12)
20.13: H5.6 U1.56(20.13)
20.14: H5.4 U1.57(20.14)
33.9: R73.1 U1.27(33.9)
33.10: R38.1 R40.1 U1.28(33.10)
D+: R69.1 U15.A6(D+) U15.B6(D+)
D-: R70.1 U15.A7(D-) U15.B7(D-)
FEEDBACK1: R5.2 R7.1 U6.5(FB)
FEEDBACK2: R19.2 R42.1 U4.5(FB)
$1N1502: R1.2 U6.4(RT/CLK)
$1N1503: C6.1 U6.1(BOOT)
$1N1505: R2.1 U6.6(COMP)
$1N1506: C6.2 L2.1 U6.8(SW)
$1N1511: C3.2 R2.2
$1N1513: R3.1 R7.2
$1N1515: C2.2 C14.1 C30.2 D1.2(K) U6.2(VIN) U6.3(EN)
$1N2229: R10.2 U4.4(RT/CLK)
$1N2230: C24.1 U4.1(BOOT)
$1N2232: R11.1 U4.6(COMP)
$1N2233: C22.2 R11.2
$1N2234: C24.2 L3.1 U4.8(SW)
$1N2243: R17.1 R42.2 R42.3
$1N2568: LED3V3.1(A) R20.2
$1N4405: D2.2 R43.2 U16.1
$1N4407: Q1.2(G) U16.2
$1N4409: CN3.1 D2.1 Q1.3(S) U16.3
$1N5126: Q2.1(B) R38.2
$1N5128: BUZZER2.2(-) Q2.3(C)
$1N5129: BUZZER2.1(+) R41.2
$1N5271: CN5.1 R74.2
$1N5272: CN5.3 R75.1
$1N6473: H2.3 R73.2
$1N48592: C40.2 U12.8(V3)
$1N48597: R69.2 U12.1(UD+)
$1N48598: R70.2 U12.2(UD-)
$1N49297: KEY1.1 R47.1 R53.2
$1N56156: R71.1 U15.B5(CC2)
$1N56179: R72.2 U15.A5(CC1)
Net-(LED2-2): LED2.2(+) R68.2
Net-(LED5V1-2): LED5V1.2(A) R6.1
Net-(LEDSTEER1-2): LEDSTEER1.2(A) R16.1
Net-(R45-1): R45.1 R51.2 SW1.1
Net-(R46-1): R46.1 R52.2 SW3.1
Net-(R48-1): R48.1 R60.2 SW4.1

Not connected (* = marked no-connect by the designer): SCREW1 1*; SCREW2 1*; SCREW3 1*; SCREW4 1*; U1 11(A11)* 22(33.4)* 23(33.5)* 24(33.6)* 25(33.7)* 29(33.11)* 30(33.12)* 33(23.1)* 34(22.0)* 35(22.1)* 36(22.2)* 37(22.3)* 38(21.2)* 39(21.3)* 40(21.4)* 41(21.5)* 44(20.0)* 46(20.3)* 53(20.10)* 64(15.6)* 65(15.7)* 66(15.8)* 74(13.0)* 75(13.1)* 76(13.2)* 77(13.3)* 80(11.6)* 81(11.9)* 82(11.10)* 83(11.11)* 84(11.12)* 86(10.2)* 90(02.0)* 91(02.1)* 92(02.2)* 93(02.3)* 94(02.4)* 95(02.5)* 98(02.8)* 99(00.0)* 100(00.1)* 101(00.2)* 102(00.3)* 103(00.4)* 104(00.5)* 105(00.6)* 106(00.7)* 107(00.8)* 108(00.9)*; U2 4(NC)*; U12 4(RTS#)*; U15 0*

## Notes on the sheet
- 1.on
- 主板
- 5V电源
- 蜂鸣器模块
- 舵机电源
- 串口转USB
- 3V3电源
- 姿态传感器
- 按键&拨码开关
- 编码器接口
- 电源接口/开关
- 电机电源接口
- 摄像头
- 有刷电机接口

# Board PCB1
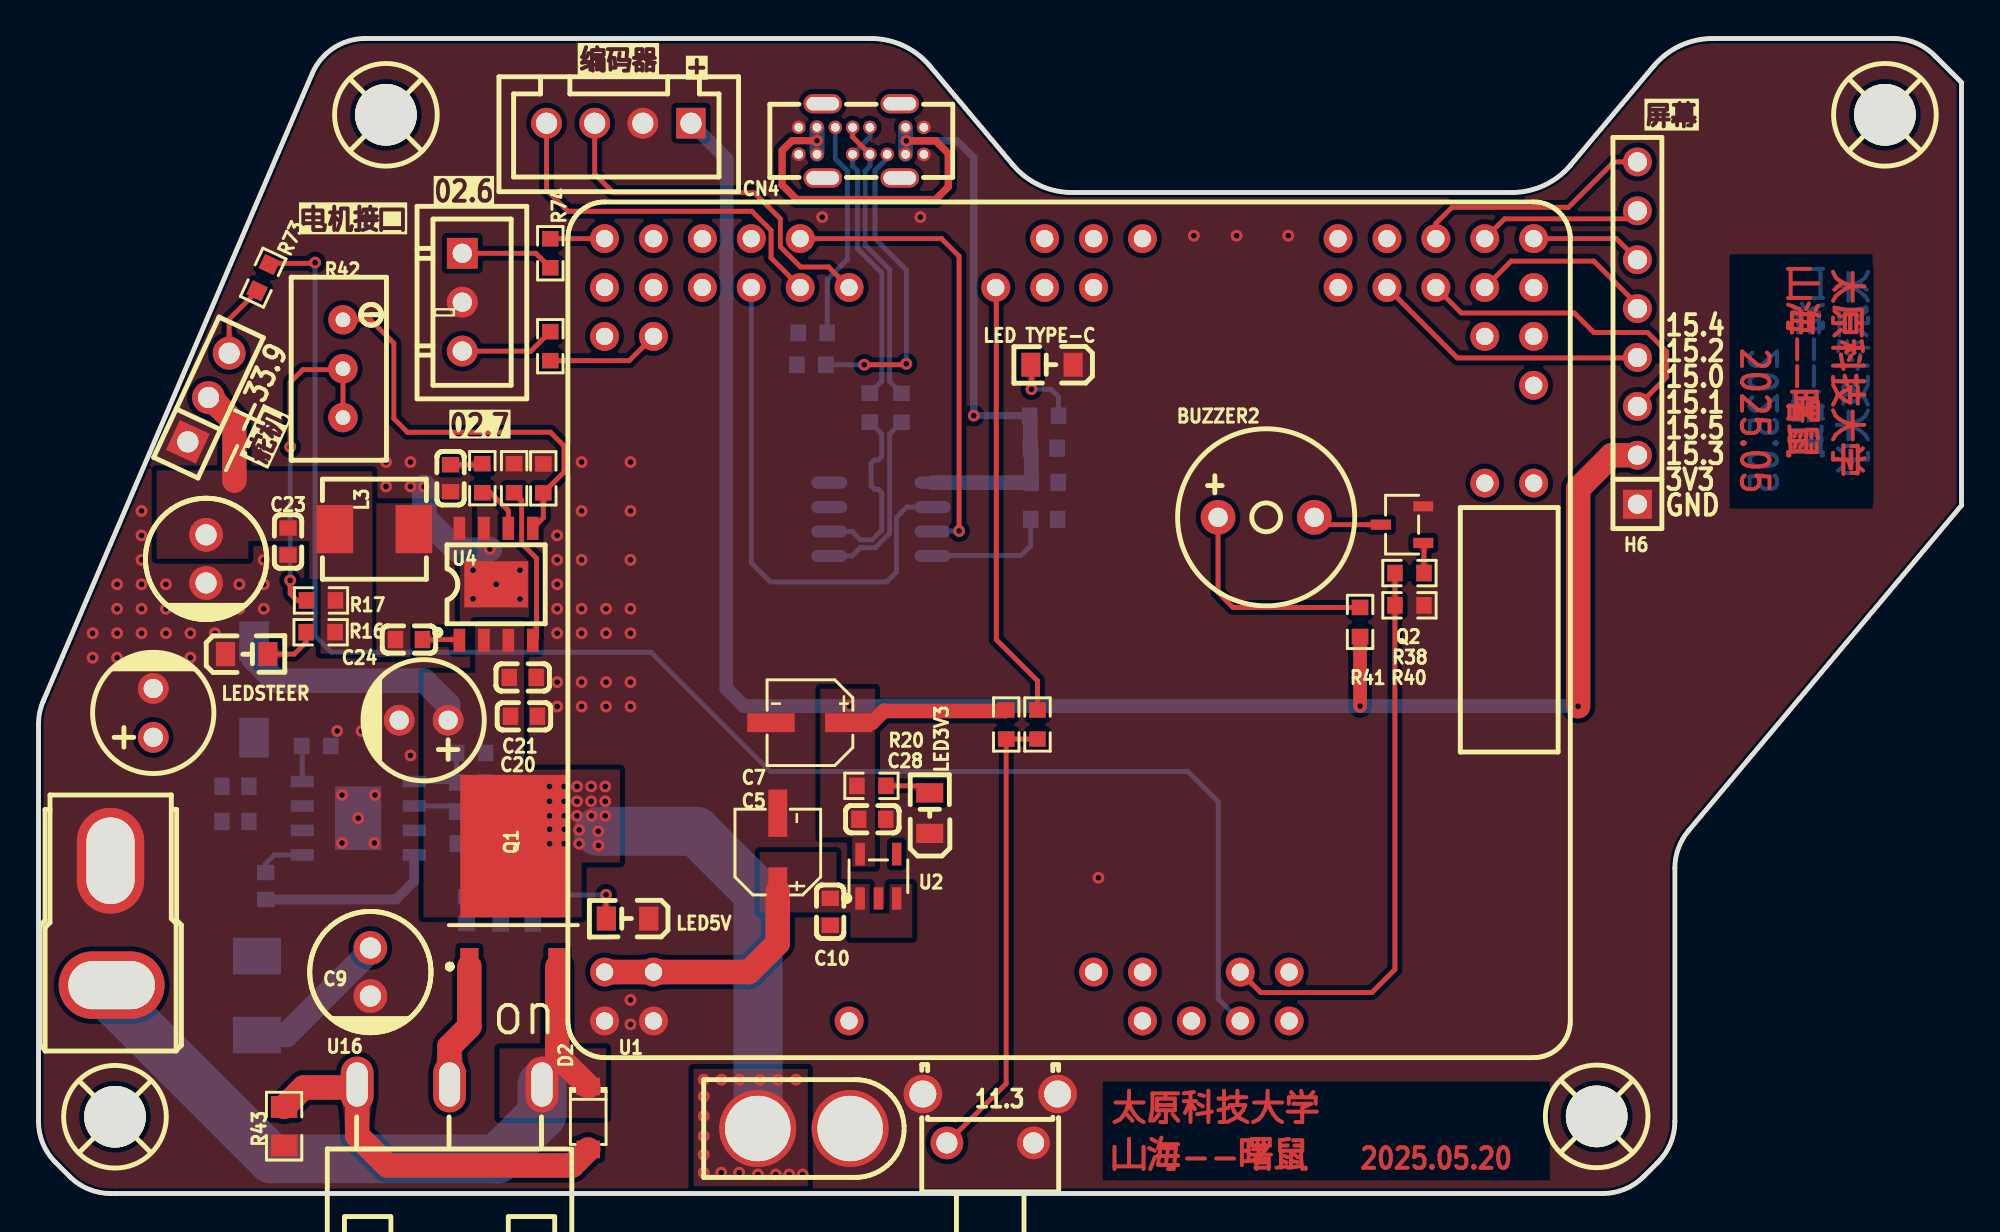
[diagram p1: board, top side]
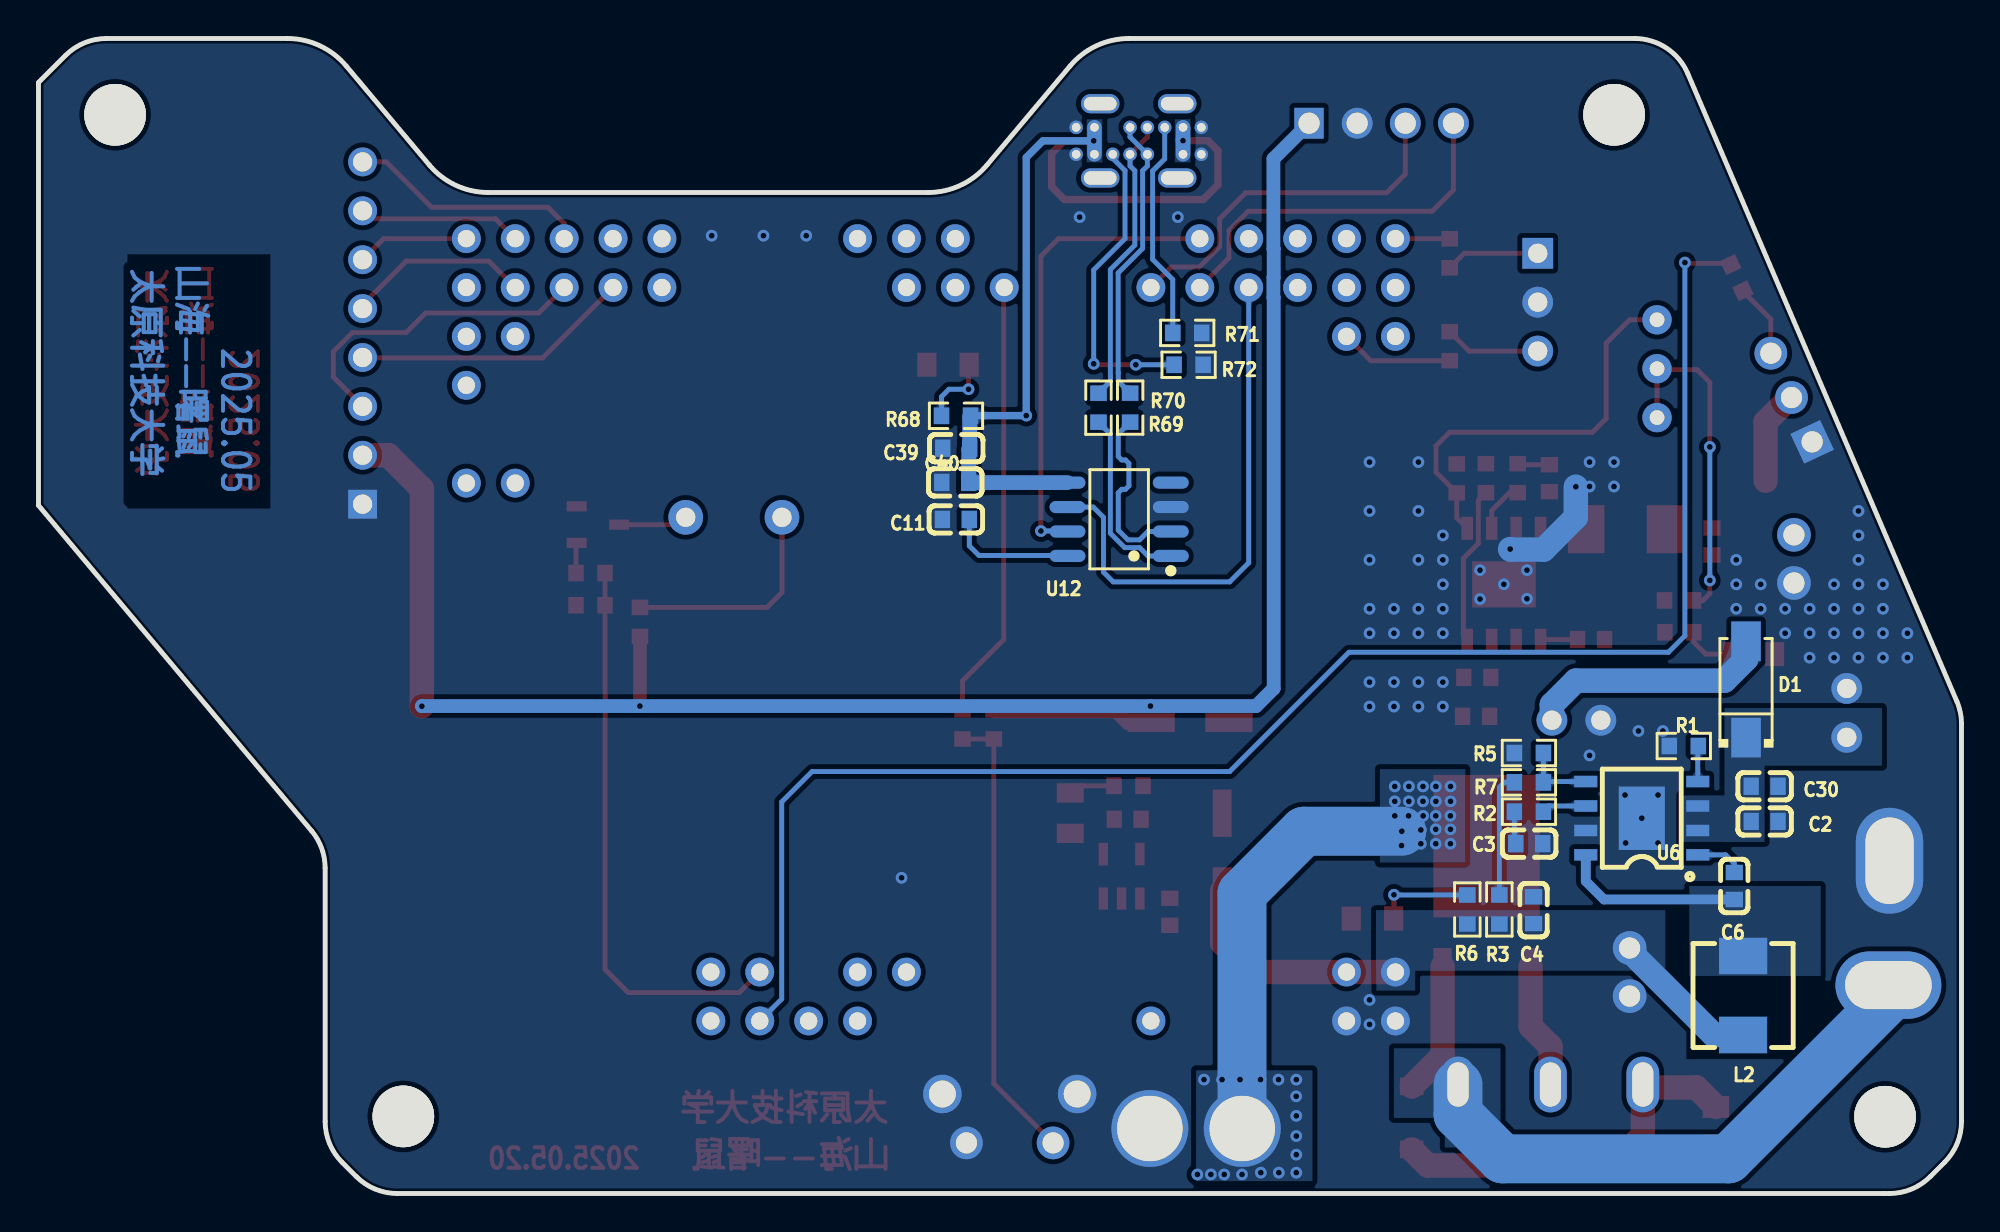
[diagram p2: board, bottom side, seen from below]

Outline 99.89 x 60 mm; copper layers: Top Layer, Bottom Layer. Coordinates in mm from the lower left corner of the outline.
Outline path: 0,24.38 0,3.74 arc(0.23,2.59) 0.88,1.62 1.62,0.88 arc(2.59,0.23) 3.74,0 81.26,0 arc(82.41,0.23) 83.38,0.88 84.12,1.62 arc(84.77,2.59) 85,3.74 85,16.91 arc(85.18,17.93) 85.7,18.84 99.89,35.75 99.89,57.71 98.48,59.12 arc(97.51,59.77) 96.36,60 86.97,60 arc(85.28,59.63) 83.9,58.57 79.59,53.43 arc(78.22,52.37) 76.53,52 53.68,52 arc(51.99,52.37) 50.62,53.43 46.3,58.57 arc(44.93,59.63) 43.24,60 16.98,60 arc(15.33,59.5) 14.22,58.18 0.24,25.57 arc(0.06,24.99) 0,24.38
Stack: Top Layer 0.035mm / Dielectric1 1.51mm FR4 er 4.5 / Bottom Layer 0.035mm

## Design rules (mm)
net $1N48597: DP3
net D+: DP1
net $1N48598: DP3
net D-: DP1
template: 自定义配置
spacing copperThickness1oz (default): track to track 0.102, other pairs 0.152 to 0.3
spacing copperThickness2oz: track to track 0.203, other pairs 0.152 to 0.3
track width copperThickness1oz (default): min 0.127, default 0.254, max 2.54
track width copperThickness2oz: min 0.203, default 0.254, max 2.54
differential pair differentialPair (default): width min 0.127, default 0.254, max 2.54; gap min 0.152, default 0.152
via viaSize (default): diameter min 0.5, default 0.61, max 10; hole min 0.3, default 0.305, max 6.3

## Placement (name value [footprint] x y rotation side)
BUZZER2  3kHz  [BUZ-TH_BD9.0-P5.00-D0.6-FD]  63.77 35.13 0 top
C2  100nF  [C0603]  10.23 19.33 0 bottom
C3  4.7nF  [C0603]  22.46 18.18 0 bottom
C4  47uF  [C0603]  22.23 14.72 270 bottom
C5  10uF  [CAP-SMD_BD4.0-L4.3-W4.3-LS5.3-FD]  38.4 17.74 90 top
C6  100nF  [C0603]  11.8 15.97 270 bottom
C7  10uF  [CAP-SMD_BD4.0-L4.3-W4.3-LS5.3-FD]  40.07 24.46 180 top
C9  220uF  [CAP-TH_BD6.3-P2.50-D0.6-FD-1]  17.24 11.5 270 top
C10  100nF  [C0603]  41.12 14.64 90 top
C11  100nF  [C0603]  52.27 36.94 0 bottom
C14  100uF  [CAP-TH_BD6.3-P2.50-D1.0-FD]  5.96 24.97 90 top
C20  4.7uF  [C0603]  25.22 24.79 180 top
C21  100nF  [C0603]  25.15 26.81 180 top
C22  4.7nF  [C0603]  21.4 37.16 90 top
C23  47uF  [C0603]  12.96 33.87 90 top
C24  100nF  [C0603]  19.24 28.78 180 top
C25  220uF  [CAP-TH_BD6.3-P2.50-D0.6-FD-1]  8.7 32.97 270 top
C26  100uF  [CAP-TH_BD6.3-P2.50-D1.0-FD]  20.01 24.59 180 top
C28  100nF  [C0603]  43.31 19.44 180 top
C30  4.7uF  [C0603]  10.23 21.16 0 bottom
C39  100nF  [C0603]  52.22 38.72 0 bottom
C40  100nF  [C0603]  52.24 35.02 180 bottom
CN3  AM-1015B-M  [CONN-TH_AM-1015B-M]  3.77 14.05 90 top
CN4  ZX-XH2.54-4PZZ  [CONN-TH_4P-P2.50_4PIN]  30.14 55.6 180 top
CN5  ZX-XH2.54-3PZZ  [CONN-TH_3P-P2.54_2501S-3P]  22.01 46.3 270 top
D1  SS54  [SMA_L4.4-W2.8-LS5.4-R-RD]  11.19 26.19 90 bottom
D2  BZT52C16  [SOD-123_L2.7-W1.6-LS3.7-RD]  28.56 3.93 270 top
H2  PZ254V-11-03P  [HDR-TH_3P-P2.54-V-M]  8.83 41.35 65 top
H6  -  [HDR-TH_8P-P2.54-V-M]  83.05 44.7 90 top
KEY1  1-1825027-1  [KEY-TH_1-1825027-1]  49.44 3.9 0 top
L2  4.7uH  [IND-SMD_L5.4-W5.2_FXL0530]  11.34 10.29 270 bottom
L3  4.7uH  [IND-SMD_L5.4-W5.2_FXL0530]  17.45 34.51 180 top
LED3V3  SML-H12P8TT86  [LED0805-R-RD_GREEN]  46.3 19.76 90 top
LED5V  -  [LED_0805]  30.55 14.29 180 top
LED TYPE-C  NCD0805R1  [LED0805-RD]  52.65 43.05 180 top
LEDSTEER  -  [LED_0805]  10.86 28.01 0 top
Q1  HY19P03  [TO-252AA-TO-252AA_N]  24.67 16.16 0 top
Q2  S8050 J3Y  [SOT-23-3_L3.0-W1.7-P0.95-LS2.9-BR]  70.83 34.75 0 top
R1  200kΩ  [R0603]  14.42 23.25 180 bottom
R2  20kΩ  [R0603]  22.47 19.84 0 bottom
R3  51kΩ  [R0603]  24.01 14.75 270 bottom
R5  10kΩ  [R0603]  22.47 22.88 180 bottom
R6  4.7kΩ  [R0603]  25.67 14.76 270 bottom
R7  1.5kΩ  [R0603]  22.47 21.36 0 bottom
R10  200kΩ  [R0603]  24.71 37.16 270 top
R11  20kΩ  [R0603]  23.05 37.16 90 top
R16  10kΩ  [R0603]  14.66 29.16 0 top
R17  27kΩ  [R0603]  14.67 30.81 0 top
R19  8.2kΩ  [R0603]  26.22 37.15 270 top
R20  2.7kΩ  [R0603]  43.27 21.18 0 top
R38  4.7kΩ  [R0603]  71.21 32.23 0 top
R40  1kΩ  [R0603]  71.21 30.55 0 top
R41  10Ω  [R0603]  68.65 29.69 90 top
R42  100kΩ  [RES-ADJ-TH_3P-L9.7-W5.0-P2.54_T93YA203KT20]  15.82 42.85 270 top
R43  10kΩ  [R0805]  12.76 3.5 90 top
R47  470Ω  [R0603]  51.89 24.37 90 top
R53  4.7kΩ  [R0603]  50.27 24.37 270 top
R68  4.7kΩ  [R0603]  52.23 40.4 0 bottom
R69  10Ω  [R0603]  44.83 40.82 270 bottom
R70  10Ω  [R0603]  43.18 40.83 270 bottom
R71  5.1kΩ  [R0603]  40.22 44.71 180 bottom
R72  5.1kΩ  [R0603]  40.15 43.05 0 bottom
R73  100Ω  [R0603]  11.67 47.57 245 top
R74  100Ω  [R0603]  26.59 48.84 270 top
R75  100Ω  [R0603]  26.59 44.02 270 top
SCREW1  -  [M3螺丝]  3.97 3.99 0 top
SCREW2  -  [M3螺丝]  18.05 56.04 0 top
SCREW3  -  [M3螺丝]  80.94 4.01 0 top
SCREW4  -  [M3螺丝]  95.91 56.04 0 top
U1  TC264_CoreBoard  [TC264_main]  29.4 8.96 90 top
U2  RT9013-33GB  [SOT-23-5_L3.0-W1.7-P0.95-LS2.8-BL]  43.63 16.48 0 top
U4  SCT2450STER  [ESOP-8_L4.9-W3.9-P1.27-LS6.0-BL-EP]  23.77 31.65 0 top
U6  SCT2450STER  [ESOP-8_L4.9-W3.9-P1.27-LS6.0-BL-EP]  16.61 19.5 90 bottom
U10  XT30U-F  [CONN-TH_XT30U-F]  39.76 3.38 0 top
U12  CH340N  [SOP-8_L4.9-W3.9-P1.27-LS6.0-BL]  43.76 35.02 90 bottom
U15  TYPE-C 14PLC-H10.0  [USB-C-TH_SHOUHAN_TYPE-C-14PLC-H10.0]  42.74 54.68 180 top
U16  SS12D10G6-WJ  [SW-TH_3P-P4.80_HX-SS12D10G6-WJ]  21.35 5.66 0 top

## Footprints (pads in the part's own frame, mm; a bottom-side part is the same pattern mirrored in y, then rotated)
BUZ-TH_BD9.0-P5.00-D0.6-FD
  round 1.8 hole 1: 1(-2.5,0) 2(2.5,0)
C0603
  rect 0.8x0.9 smd: 1(-0.7,0) 2(0.7,0)
CAP-SMD_BD4.0-L4.3-W4.3-LS5.3-FD
  rect 2.46x0.98 smd: 1(-2.02,0) 2(2.02,0)
CAP-TH_BD6.3-P2.50-D0.6-FD-1
  round 1.75 hole 1.1: 1(-1.25,0) 2(1.25,0)
CAP-TH_BD6.3-P2.50-D1.0-FD
  round 1.6 hole 1: 1(-1.27,0) 2(1.27,0)
CONN-TH_3P-P2.54_2501S-3P
  rect 1.6x1.6 hole 1: 1(-2.54,0)
  round 1.6 hole 1: 2(0,0) 3(2.54,0)
CONN-TH_4P-P2.50_4PIN
  rect 1.524x1.6 hole 1.1: 1(-3.75,0)
  round 1.6 hole 1.1: 2(-1.25,0) 3(1.25,0) 4(3.75,0)
CONN-TH_AM-1015B-M
  oval 3.5x5.5 hole 2.5x4.5: 1(-3.231,-0.029)
  oval 5.5x3.5 hole 4.5x2.5: 2(3.231,0.029)
CONN-TH_XT30U-F
  round 4 hole 3.4: 1(2.4,0) 2(-2.4,0)
ESOP-8_L4.9-W3.9-P1.27-LS6.0-BL-EP
  rect 0.6x1.2 smd: 1(-1.905,-2.909) 2(-0.635,-2.909) 3(0.635,-2.909) 4(1.905,-2.909) 5(1.905,2.909) 6(0.635,2.909) 7(-0.635,2.909) 8(-1.905,2.909)
  rect 3.3x2.4 smd: 9(0,0)
HDR-TH_3P-P2.54-V-M
  rect 1.7x1.7 hole 1.1: 1(-2.54,0)
  round 1.7 hole 1.1: 2(0,0) 3(2.54,0)
HDR-TH_8P-P2.54-V-M
  rect 1.5x1.5 hole 1: 1(-8.89,0)
  round 1.5 hole 1: 2(-6.35,0) 3(-3.81,0) 4(-1.27,0) 5(1.27,0) 6(3.81,0) 7(6.35,0) 8(8.89,0)
IND-SMD_L5.4-W5.2_FXL0530
  rect 1.9x2.5 smd: 1(-2.05,0) 2(2.05,0)
KEY-TH_1-1825027-1
  round 2 hole 1.4: 0(-3.5,1.27) 0(3.5,1.27)
  round 1.7 hole 1.1: 1(-2.25,-1.27) 2(2.25,-1.27)
LED0805-R-RD_GREEN
  rect 1x1.399 smd: 1(1.05,0) 2(-1.05,0)
LED0805-RD
  rect 1x1.25 smd: 1(-1.1,0) 2(1.1,0)
LED_0805
  rect 1x1.25 smd: 1(-1.15,0.005) 2(1.05,0.005)
M3螺丝
  round 3.2 hole 3.2: 1(0,0)
R0603
  rect 0.806x0.864 smd: 1(-0.753,0) 2(0.753,0)
R0805
  rect 1.133x1.377 smd: 1(-1,0) 2(1,0)
RES-ADJ-TH_3P-L9.7-W5.0-P2.54_T93YA203KT20
  round 1.524 hole 0.762: 1(-2.54,0) 2(0.001,0) 3(2.54,0)
SMA_L4.4-W2.8-LS5.4-R-RD
  rect 2.062x1.539 smd: 1(2.503,0) 2(-2.503,0)
SOD-123_L2.7-W1.6-LS3.7-RD
  rect 0.91x1.22 smd: 1(-1.635,0) 2(1.635,0)
SOP-8_L4.9-W3.9-P1.27-LS6.0-BL
  oval 0.63x1.865 smd: 1(-1.905,-2.683) 2(-0.635,-2.683) 3(0.635,-2.683) 4(1.905,-2.683) 5(1.905,2.683) 6(0.635,2.683) 7(-0.635,2.683) 8(-1.905,2.683)
SOT-23-3_L3.0-W1.7-P0.95-LS2.9-BR
  rect 1.038x0.532 smd: 1(1.101,-0.95) 2(1.101,0.95) 3(-1.101,0)
SOT-23-5_L3.0-W1.7-P0.95-LS2.8-BL
  rect 0.49x1.157 smd: 1(-0.95,-1.153) 2(0,-1.153) 3(0.95,-1.153)
  rect 0.49x1.175 smd: 4(0.95,1.153) 5(-0.95,1.153)
SW-TH_3P-P4.80_HX-SS12D10G6-WJ
  oval 1.7x2.9 hole 1.1x2.3: 1(-4.8,0) 2(0,0) 3(4.8,0)
TC264_main
  round 1.5 hole 0.9: 1(0,0) 2(2.54,0) 3(0,-2.54) 4(2.54,-2.54) 11(0,-12.7) 22(2.54,-25.4) 23(0,-27.94) 24(2.54,-27.94) 25(0,-30.48) 27(0,-33.02) 28(2.54,-33.02) 29(0,-35.56) 30(2.54,-35.56) 49(27.94,-45.72) 50(27.94,-48.26) 54(33.02,-48.26) 55(35.56,-45.72) 56(35.56,-48.26) 57(38.1,-48.26) 58(40.64,-48.26) 59(38.1,-45.72) 60(40.64,-45.72) 61(38.1,-43.18) 62(40.64,-43.18) 63(38.1,-40.64) 64(40.64,-40.64) 65(38.1,-38.1) 66(40.64,-38.1) 74(40.64,-27.94) 75(38.1,-25.4) 76(40.64,-25.4) 77(38.1,-22.86) 78(40.64,-22.86) 79(38.1,-20.32) 85(38.1,-12.7) 87(38.1,-10.16) 88(40.64,-10.16) 89(38.1,-7.62) 90(40.64,-7.62) 91(38.1,-5.08) 92(40.64,-5.08) 93(38.1,-2.54) 94(40.64,-2.54) 95(38.1,0) 96(40.64,0) 97(35.56,-2.54) 98(35.56,0)
TO-252AA-TO-252AA_N
  rect 5.524x7.404 smd: 1(0,1.879)
  rect 0.953x1.917 smd: 2(-2.286,-4.369) 3(2.286,-4.369)
USB-C-TH_SHOUHAN_TYPE-C-14PLC-H10.0
  oval 2x1 hole 1.7x0.7: 0(-2,1.93) 0(-2,-1.93) 0(2,1.93) 0(2,-1.93)
  round 0.7 hole 0.45: A1(-3.25,0.7) A4(-2.3,0.7) A5(-1.35,0.7) A6(-0.45,0.7) A7(0.45,0.7) A9(2.3,0.7) A12(3.25,0.7) B1(3.25,-0.7) B4(2.3,-0.7) B5(1.35,-0.7) B6(0.45,-0.7) B7(-0.45,-0.7) B9(-2.3,-0.7) B12(-3.25,-0.7)

## Nets
As in the schematic, except:
GND: C2.1 C3.1 C4.1 C5.2 C7.2 C9.2 C10.1 C11.2 C14.2 C20.1 C21.1 C22.1 C23.1 C25.2 C26.2 C28.1 C30.1 C39.2 C40.1 CN3.2 CN4.2 CN5.2 H2.1 H6.1 KEY1.0 KEY1.2 LED3V3.2 LED5V.1 LED TYPE-C.1 LEDSTEER.1 Q2.2 R1.1 R5.1 R10.1 R19.1 R40.2 R43.1 R71.2 R72.1 U1.1 U1.3 U2.2 U4.7 U4.9 U6.7 U6.9 U10.1 U12.3 U15.A1 U15.A12 U15.B1 U15.B12
$1N1508: LED5V.2 R6.1
$1N2242: LEDSTEER.2 R16.1
$1N48585: LED TYPE-C.2 R68.2

Pads without a net: SCREW1 1; SCREW2 1; SCREW3 1; SCREW4 1; U1 11 22 23 24 25 29 30 64 65 66 74 75 76 77 90 91 92 93 94 95 98; U2 4; U12 4; U15 0

## Via types
v1: diameter 0.61, hole 0.305, Top Layer to Bottom Layer, 133 vias

## Routing (per net, layer and track width the routed paths; a pad name or vN(x,y) marks a point on that pad's centre or on a via; arc(x,y) is an arc through that point)
12V: length 34.5
  Bottom Layer w1.27: C26.1 21.28,25.4 20.03,26.64 12.31,26.64 11.19,27.76 11.19,28.69
  Bottom Layer w2.54: v1(29.07,18.82) 34.15,18.82 37.37,15.6 37.37,3.52
  vias: v1(26.54,21.15) v1(26.54,20.37) v1(26.55,19.62) v1(26.55,18.92) v1(26.55,18.17) v1(27.3,21.15) v1(27.3,20.37) v1(27.31,19.62) v1(27.31,18.92) v1(27.31,18.17) v1(27.97,21.15) v1(27.97,20.37) v1(27.97,19.62) v1(28.08,18.89) v1(28.08,18.17) v1(28.71,21.15) v1(28.71,20.37) v1(28.72,19.62) v1(29.09,18.08) v1(29.44,21.15) v1(29.44,20.37) v1(29.44,19.62) v1(34.55,5.92) v1(34.56,5.05) v1(34.55,4.03) v1(34.55,2.98) v1(34.55,2.02) v1(34.55,1.08) v1(35.46,1.08) v1(35.48,5.92) v1(36.41,5.92) v1(36.4,1.08) v1(37.37,0.99) v1(37.48,5.92) v1(38.3,0.99) v1(38.41,5.92) v1(38.99,0.99) v1(39.35,5.92) v1(39.69,0.99)
+5V: length 20.2
  Top Layer w1.27: C5.1 38.4,13.01 36.9,11.5 U1.4 U1.2
  Bottom Layer w1.27: C9.1 17.24,12.6 12.87,8.24 L2.2
GND: length 5.7
  Bottom Layer w1.27: v1(20.03,36.72) 20.03,35.13 21.71,33.45 23.42,33.45 v1(23.45,33.48)
  vias: v1(2.81,29.11) v1(2.81,27.84) v1(4.08,31.65) v1(4.08,30.38) v1(4.08,29.11) v1(4.08,27.84) v1(5.35,35.46) v1(5.35,34.19) v1(5.35,32.92) v1(5.35,31.65) v1(5.35,30.38) v1(5.35,29.11) v1(5.35,27.84) v1(6.62,31.65) v1(6.62,30.38) v1(6.62,29.11) v1(6.62,27.84) v1(7.89,30.38) v1(7.89,29.11) v1(7.89,27.84) v1(9.16,30.38) v1(9.16,29.11) v1(10.43,31.65) v1(10.43,30.38) v1(11.7,32.92) v1(11.7,31.65) v1(11.7,30.38) v1(15.51,24.03) v1(15.76,20.7) v1(15.76,18.21) v1(16.61,19.5) v1(16.78,24.03) v1(17.45,18.21) v1(17.48,20.7) v1(18.05,38) v1(18.05,36.73) v1(19.32,38) v1(19.32,36.73) v1(19.32,22.76) v1(22.57,32.38) v1(22.57,30.89) v1(23.77,31.65) v1(25.01,32.38) v1(25.01,30.88) v1(26.94,34.19) v1(26.94,32.92) v1(26.94,31.65) v1(26.94,30.38) v1(26.94,29.11) v1(26.94,26.57) v1(26.94,25.3) v1(28.21,38) v1(28.21,35.46) v1(28.21,32.92) v1(28.21,30.38) v1(28.21,29.11) v1(28.21,26.57) v1(28.21,25.3) v1(29.48,30.38) v1(29.48,29.11) v1(29.48,26.57) v1(29.48,25.3) v1(30.75,38) v1(30.75,35.46) v1(30.75,32.92) v1(30.75,30.38) v1(30.75,29.11) v1(30.75,26.57) v1(30.75,25.3) v1(30.75,10.06) v1(30.75,8.79) v1(40.71,50.72) v1(45.81,50.72) v1(55.06,16.4) v1(60.01,49.76) v1(62.23,49.76) v1(64.92,49.76)
VBUS: length 48.8
  Top Layer w0.381: v1(45.08,54.68) 46.6,54.68 47.26,54.02 47.26,52.3 46.6,51.64 39.39,51.64 38.62,52.4 38.62,54.18 39.14,54.69 v1(40.44,54.69)
  Bottom Layer w0.381: v1(45.08,54.68) 47.72,54.68 48.58,53.82 v1(48.58,40.41) 51.47,40.41
  Bottom Layer w0.762: U15.A9 v1(40.44,54.69) U15.B4 ; R68.1 51.52,40.36 C39.1 51.57,38.67 C11.1 51.56,36.93 U12.5 ; 45.04,53.98 45.04,55.38
VCC3V3: length 101.9
  Top Layer w0.711: v1(68.65,25.32) R41.1
  Top Layer w0.762: C7.1 43.3,24.46 43.91,25.07 50.22,25.07 R53.1
  Top Layer w1.27: H6.2 81.72,38.35 79.98,36.61 v1(79.98,25.31)
  Bottom Layer w0.711: v1(79.98,25.31) 79.97,25.32 v1(68.65,25.32) v1(42.13,25.32) 36.64,25.32 35.73,26.24 35.73,46.53 35.74,46.54 35.74,47.59 35.73,47.6 35.73,49.07 35.74,49.08 35.74,53.75 CN4.1
VCCSTEER: length 4.9
  Top Layer w1.27: 10.18,37.03 10.18,40.08 8.91,41.35 H2.2
02.6: length 2.8
  Top Layer w0.254: R74.1 26.59,49.6 U1.96
02.7: length 5.9
  Top Layer w0.254: R75.2 30.68,43.26 U1.97
10.1: length 19.1
  Top Layer w0.254: U1.85 41.04,48.13 39.58,48.13 38.54,49.18 38.54,50.63 37.18,51.99 29.86,51.99 28.89,52.96 CN4.3
10.3: length 19.6
  Top Layer w0.254: CN4.4 26.39,52.14 27.5,51.03 37.06,51.03 38.05,50.03 38.05,48.6 39.56,47.09 U1.87
10.5: length 24.3
  Top Layer w0.254: v1(47.82,34.42) 47.82,48.69 46.91,49.6 U1.88
  Bottom Layer w0.254: U12.7 46.46,34.42 v1(47.82,34.42)
10.6: length 27.4
  Bottom Layer w0.254: U12.6 45.1,35.66 44.57,35.13 44.57,32.28 44.06,31.77 38.02,31.77 37.02,32.76 U1.89
11.3: length 22.8
  Top Layer w0.254: R47.2 51.89,26.63 49.75,28.78 49.75,47.04 U1.79
15.0: length 5.8
  Top Layer w0.254: U1.58 81.96,49.6 H6.6
15.1: length 9.6
  Top Layer w0.254: U1.59 76.5,48.44 80.79,48.44 83.05,46.17 H6.5
15.2: length 8.5
  Top Layer w0.254: H6.7 82.64,50.63 76.15,50.63 U1.60
15.3: length 16.8
  Top Layer w0.254: H6.3 84.58,42.41 84.58,43.74 83.58,44.73 80.79,44.73 79.77,45.74 73.91,45.74 U1.61
15.4: length 12.6
  Top Layer w0.254: U1.62 72.58,50.39 73.42,51.23 79.47,51.23 81.83,53.59 H6.8
15.5: length 14.5
  Top Layer w0.254: H6.4 83.03,43.41 73.7,43.41 U1.63
33.9: length 84.1
  Top Layer w0.254: 12.05,48.32 14.33,48.32 v1(14.37,48.36)
  Bottom Layer w0.254: U1.27 61.28,10.11 61.28,20.34 59.71,21.92 38.02,21.92 31.82,28.12 15.22,28.12 14.37,28.97 v1(14.37,48.36)
33.10: length 29.6
  Top Layer w0.254: U1.28 63.49,10.44 69.26,10.44 70.46,11.64 R40.1 R38.1
D+: length 15.1
  Top Layer w0.254: U15.A6 42.29,54.88 U15.B6
  Bottom Layer w0.254: R69.1 44.21,42.2 44.21,42.45 44.21,42.46 44.21,47.99 42.94,49.27 42.94,53.13 43.19,53.38 U15.A6
D-: length 15.1
  Bottom Layer w0.254: R70.1 43.8,42.2 43.8,42.62 43.81,42.62 43.81,47.83 42.54,49.1 42.54,53.13 42.29,53.38 U15.A7 43.19,54.88 U15.B7
FEEDBACK1: length 3.7
  Bottom Layer w0.254: U6.5 21.68,21.4 R7.1 R5.2
FEEDBACK2: length 21.4
  Top Layer w0.254: 25.68,34.56 26.22,35.1 R19.2 27.3,37.47 27.3,38.83 26.59,39.55 19.17,39.55 18.46,40.26 18.46,44.17 17.24,45.39 R42.1
$1N1502: length 1.9
  Bottom Layer w0.254: 13.67,23.25 13.7,23.22 U6.4
$1N1503: length 2.6
  Bottom Layer w0.254: U6.1 12.25,17.59 11.8,17.14 C6.1
$1N1505: length 2.3
  Bottom Layer w0.254: U6.6 21.42,20.13 R2.1
$1N1506: length 9.5
  Bottom Layer w0.508: C6.2 18.57,15.27 19.52,16.22 U6.8
$1N1508: length 5.1
  Top Layer w0.254: v1(29.48,15.52) 29.48,14.3 LED5V.2
  Bottom Layer w0.254: v1(29.48,15.52) 29.47,15.51 R6.1
$1N1511: length 1.7
  Bottom Layer w0.254: C3.2 23.22,18.24 R2.2
$1N1513: length 6.5
  Bottom Layer w0.254: R7.2 23.75,21.36 24.01,21.11 R3.1
$1N2229: length 8.2
  Top Layer w0.254: U4.4 25.87,28.94 25.87,32.99 25.1,33.77 25.1,36.01 R10.2
$1N2230: length 1.9
  Top Layer w0.254: C24.1 21.83,28.78 U4.1
$1N2232: length 2.7
  Top Layer w0.254: R11.1 23.48,36.4 24.41,35.48 24.41,34.56
$1N2233: length 1.7
  Top Layer w0.254: R11.2 23,37.86 C22.2
$1N2242: length 2.8
  Top Layer w0.254: R16.1 13.9,28.64 13.28,28.02 LEDSTEER.2
$1N2243: length 17.5
  Top Layer w0.254: v1(13.07,31.85) 13.07,31.16 13.43,30.81 R17.1 ; R42.3 15.82,42.85 15.77,42.8 13.73,42.8 13.07,42.14 v1(13.07,38.78)
  Bottom Layer w0.254: v1(13.07,38.78) v1(13.07,31.85)
$1N2568: length 2.4
  Top Layer w0.254: LED3V3.1 45.93,21.18 R20.2
$1N4405: length 19.9
  Top Layer w1.27: R43.2 13.77,5.51 16.4,5.51 U16.1 16.55,3.02 18.12,1.45 27.72,1.45 D2.2
$1N4407: length 6.6
  Top Layer w1.27: Q1.2 22.38,8.67 21.35,7.64 U16.2
$1N4409: length 35.8
  Top Layer w1.27: D2.1 26.95,7.16 Q1.3
  Bottom Layer w2.54: 3.72,10.72 3.72,10.19 12.11,1.8 23.84,1.8 26.15,4.11 U16.3
$1N5126: length 1.6
  Top Layer w0.254: R38.2 71.97,33.76 Q2.1
$1N5128: length 3.4
  Top Layer w0.254: 66.48,35 66.73,34.75 Q2.3
$1N5129: length 11.6
  Top Layer w0.254: BUZZER2.1 61.27,31.23 62.05,30.44 R41.2
$1N5271: length 4.9
  Top Layer w0.254: CN5.1 25.83,48.84 R74.2
$1N5272: length 5
  Top Layer w0.254: R75.1 25.58,43.76 CN5.3
$1N6473: length 3.8
  Top Layer w0.254: 9.9,43.65 9.9,45.42 11.35,46.87 R73.2
$1N48585: length 3.8
  Top Layer w0.254: LED TYPE-C.2 51.58,43.02 v1(51.58,41.78)
  Bottom Layer w0.254: R68.2 52.98,41.39 52.59,41.78 v1(51.58,41.78)
$1N48592: length 6.7
  Bottom Layer w0.254: C40.2 51.54,33.65 51.04,33.15 46.46,33.15 U12.8
$1N48597: length 9.7
  Bottom Layer w0.254: U12.1 42.26,33.12 42.69,33.55 43.47,33.55 44.21,34.3 44.21,39.45 R69.2
$1N48598: length 9.7
  Bottom Layer w0.254: R70.2 43.8,39.45 43.8,38.29 43.62,38.11 43.43,38.11 43.25,37.93 43.25,36.76 43.43,36.58 43.62,36.58 43.8,36.4 43.8,34.46 43.3,33.96 42.69,33.96 42.26,34.39 U12.2
$1N49297: length 23.9
  Top Layer w0.254: R47.1 R53.2 50.27,5.71 KEY1.1
$1N56156: length 11.4
  Bottom Layer w0.254: R71.1 40.97,47.48 42.02,48.53 42.02,53.12 41.39,53.75 U15.B5
$1N56179: length 16
  Top Layer w0.254: v1(42.89,43.05) 45.03,43.05 v1(45.08,43.1)
  Bottom Layer w0.254: R72.2 v1(42.89,43.05) ; U15.A5 44.09,53.78 43.45,53.14 43.45,49.6 45.08,47.98 v1(45.08,43.1)

## Copper pours and planes (outline as drawn; the poured copper is in the pictures)
12V on Top Layer: 20,29.7 30.21,29.7 30.21,14.35 20,14.35
12V on Top Layer: 34.02,6.48 39.96,6.48 39.96,0.38 34.02,0.38
12V on Bottom Layer: 25.77,22.04 30.21,22.04 30.21,17.19 25.77,17.19
12V on Bottom Layer: 33.72,6.4 39.76,6.4 39.76,0.64 33.72,0.64
+5V on Top Layer: 37.46,17.74 45.39,17.74 45.39,13.28 37.46,13.28
+5V on Bottom Layer: 15.39,14.72 30.41,14.72 30.41,10.54 15.39,10.54
GND on Top Layer: -4.45,72.39 105.27,72.39 105.27,-2.36 -4.45,-2.36
GND on Bottom Layer: -2.09,82.9 102.15,82.9 102.15,-13.95 -2.09,-13.95
VBUS on Bottom Layer: 40.05,55.8 40.86,55.8 40.86,53.57 40.05,53.57
VBUS on Bottom Layer: 44.63,55.8 45.44,55.8 45.44,53.57 44.63,53.57
VCC3V3 on Top Layer: 40.61,26.22 43.45,26.22 43.45,16.98 40.61,16.98
VCCSTEER on Top Layer: 6.14,37.56 17.34,37.56 17.34,28.05 6.14,28.05
$1N1506 on Bottom Layer: 7.31,15.97 14.14,15.97 14.14,11.3 7.31,11.3
$1N1515 on Bottom Layer: 4.13,25.22 14.56,25.22 14.56,18.26 4.13,18.26
$1N2234 on Top Layer: 17.54,35.86 22.52,35.86 22.52,27.87 17.54,27.87
$1N4409 on Top Layer: 23.94,7.54 29.48,7.54 29.48,3.93 23.94,3.93
$1N4409 on Bottom Layer: 23.94,7.54 29.48,7.54 29.48,2.39 23.94,2.39

Small or netless copper shapes (teardrops, artwork), in the pictures only: 44 on Top Layer, 51 on Bottom Layer

## Text on the board
Bottom Layer: 2025.05 | 山海——曙鼠 | 太原科技大学
Bottom Solder Mask Layer: 2025.05 | 山海——曙鼠 | 太原科技大学
Top Layer: 2025.05.20 | 2025.05 | 山海——曙鼠 | 太原科技大学 | 山海--曙鼠
Top Solder Mask Layer: 2025.05.20 | 2025.05 | 山海——曙鼠 | 太原科技大学 | 山海--曙鼠
Top Silkscreen Layer: 11.3 | 02.6 | 02.7 | + | 15.4 | 15.2 | 15.0 | 15.1 | 15.5 | 15.3 | 3V3 | GND | 33.9 | - | on | 编码器 | 屏幕 | 舵机 | 电机接口
